# EAGLE design PCB_Official (EAGLE 9.3.0)

## Sheet 1 of 3
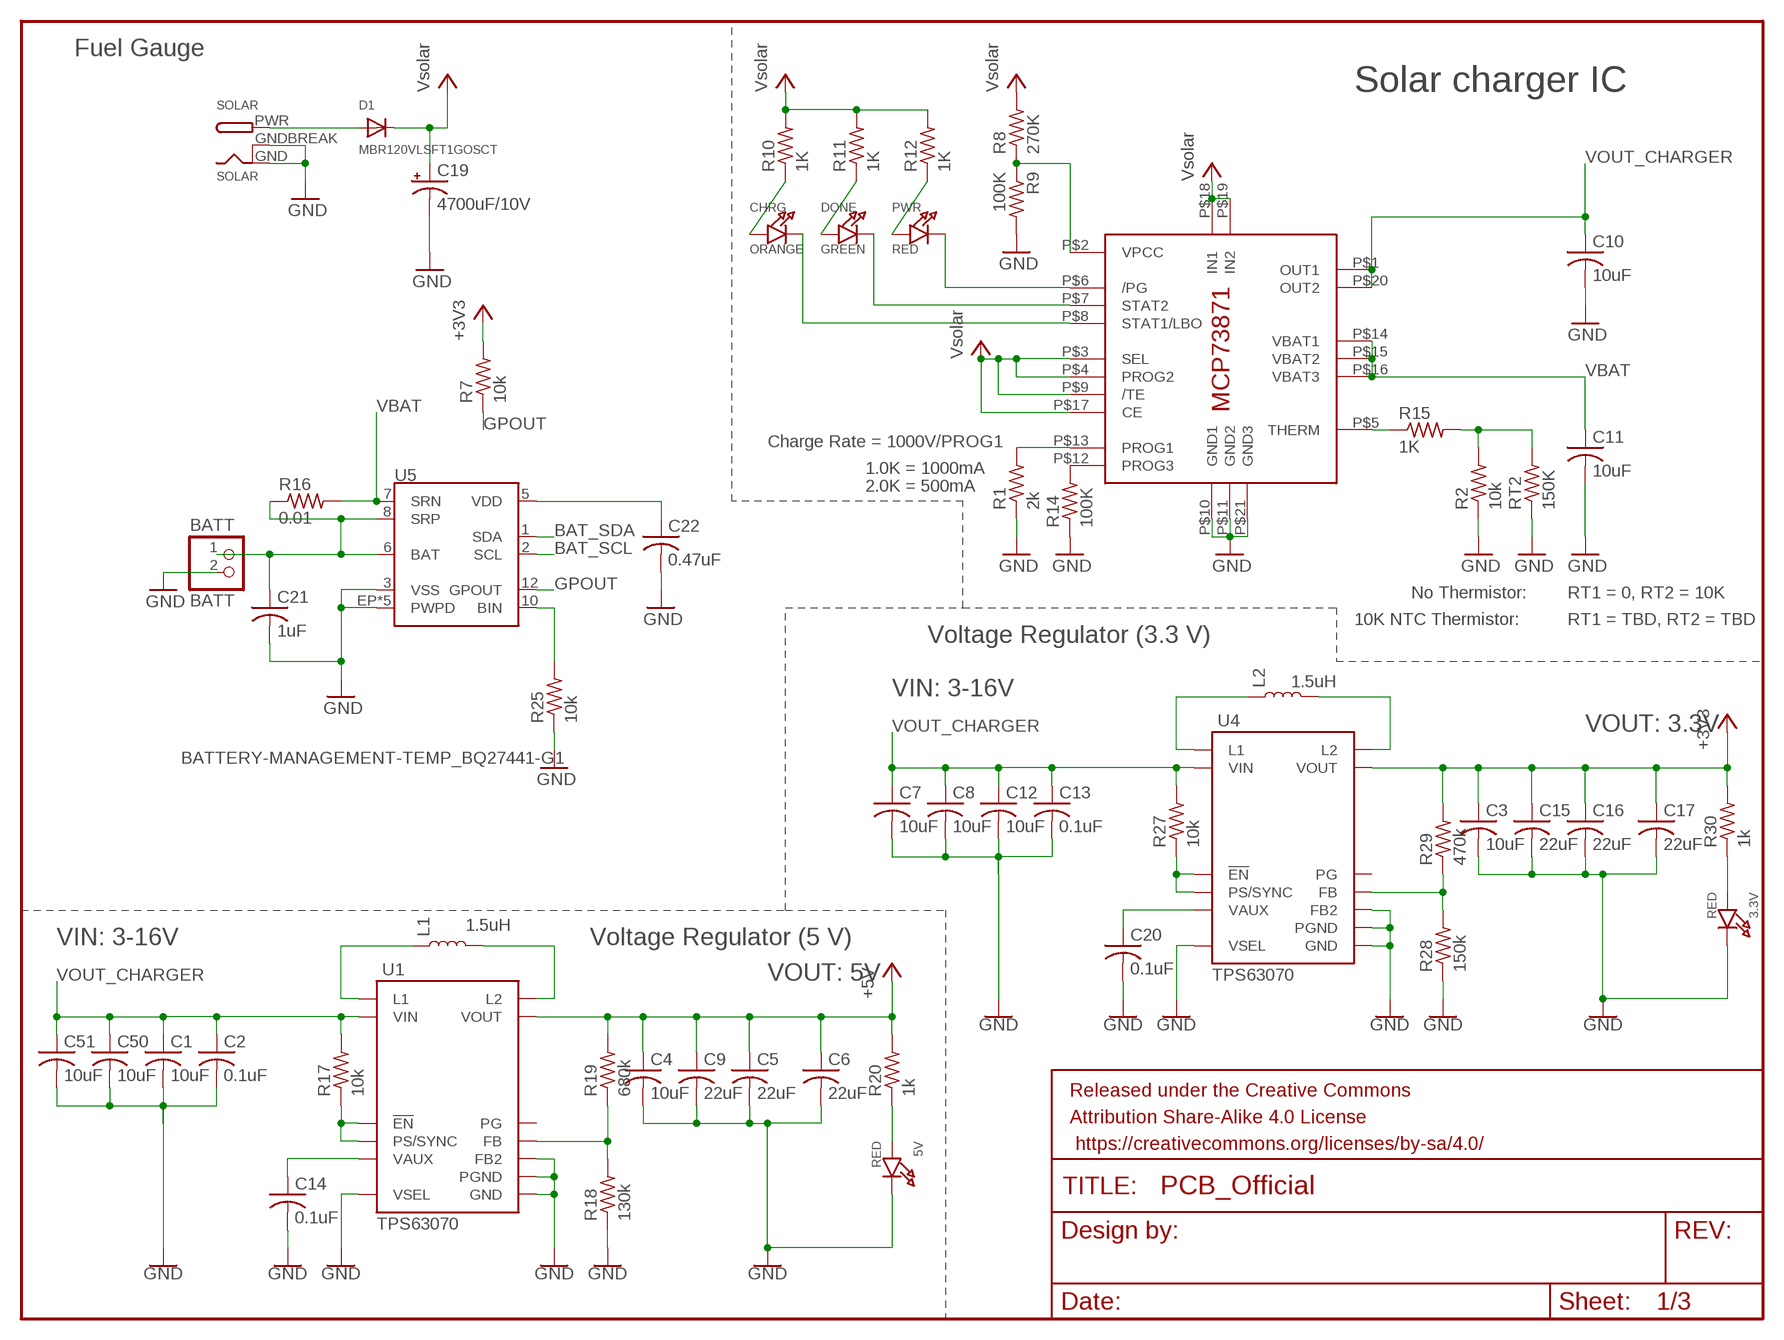
[diagram p0: schematic, sheet 1]

### Parts
3.3V  RED  LED0805_NOOUTLINE  [CHIPLED_0805_NOOUTLINE]
5V  RED  LED0805_NOOUTLINE  [CHIPLED_0805_NOOUTLINE]
BATT  BATT  JST_2PIN-SMT-RA  [JST-PH-2-SMT-RA]
C1  10uF  C-USC0805  [C0805]
C2  0.1uF  C-USC0805  [C0805]
C3  10uF  C-USC0603  [C0603]
C4  10uF  C-USC0603  [C0603]
C5  22uF  C-USC0805  [C0805]
C6  22uF  C-USC0805  [C0805]
C7  10uF  C-USC0603  [C0603]
C8  10uF  C-USC0805  [C0805]
C9  22uF  C-USC0805  [C0805]
C10  10uF  C-USC0805K  [C0805K]
C11  10uF  C-USC0805K  [C0805K]
C12  10uF  C-USC0805  [C0805]
C13  0.1uF  C-USC0805  [C0805]
C14  0.1uF  C-USC0603  [C0603]
C15  22uF  C-USC0805  [C0805]
C16  22uF  C-USC0805  [C0805]
C17  22uF  C-USC0805  [C0805]
C19  4700uF/10V  ADAFRUIT_CPOL-USE5-13  [ADAFRUIT_E5-13]
C20  0.1uF  C-USC0603  [C0603]
C21  1uF  C-USC0805  [C0805]
C22  0.47uF  C-USC0805  [C0805]
C50  10uF  C-USC0805  [C0805]
C51  10uF  C-USC0603  [C0603]
CHRG  ORANGE  LED0805_NOOUTLINE  [CHIPLED_0805_NOOUTLINE]
D1  MBR120VLSFT1GOSCT  MICROBUILDER_DIODESOD-123  [MICROBUILDER_SOD-123]
DONE  GREEN  LED0805_NOOUTLINE  [CHIPLED_0805_NOOUTLINE]
FRAME2  FRAME-LETTERNO_PACKAGE  [DUMMY]
IC1  MCP73871  [QFN20_4MM]
L1  1.5uH  INDUCTOR-XFL40201.5UH  [XFL4020]
L2  1.5uH  INDUCTOR-XFL40201.5UH  [XFL4020]
PWR  RED  LED0805_NOOUTLINE  [CHIPLED_0805_NOOUTLINE]
R1  2k  R-US_R0805  [R0805]
R2  10k  R-US_R0805  [R0805]
R7  10k  R-US_R0805  [R0805]
R8  270K  R-US_R0805  [R0805]
R9  100K  R-US_R0805  [R0805]
R10  1K  R-US_R0805  [R0805]
R11  1K  R-US_R0805  [R0805]
R12  1K  R-US_R0805  [R0805]
R14  100K  R-US_R0805  [R0805]
R15  1K  R-US_M0805  [M0805]
R16  0.01  R-US_R0805  [R0805]
R17  10k  R-US_R0603  [R0603]
R18  130k  R-US_R0603  [R0603]
R19  680k  R-US_R0603  [R0603]
R20  1k  R-US_R0603  [R0603]
R25  10k  R-US_R0805  [R0805]
R27  10k  R-US_R0603  [R0603]
R28  150k  R-US_R0603  [R0603]
R29  470k  R-US_R0603  [R0603]
R30  1k  R-US_R0603  [R0603]
RT2  150K  R-US_M0805  [M0805]
SOLAR  SOLAR  DCBARRELPTH  [DCJACK_2MM_PTH]
U1  TPS63070  [VQFN-15-HR(3X2.5)]
U4  TPS63070  [VQFN-15-HR(3X2.5)]
U5  BATTERY-MANAGEMENT-TEMP_BQ27441-G1  [BATTERY-MANAGEMENT-TEMP_PDSO-N12]

### Nets
!EN: R17.1 U1.P$1(PS/SYNC) U1.P$14(!EN)
!EN1: R27.1 U4.P$1(PS/SYNC) U4.P$14(!EN)
+3V3: C3.1 C15.1 C16.1 C17.1 R7.2 R29.2 R30.2 U4.P$7/8(VOUT) ; also sheet 2,3
+5V: C4.1 C5.1 C6.1 C9.1 R19.2 R20.2 U1.P$7/8(VOUT) ; also sheet 2,3
BAT_SCL: U5.2(SCL) ; also sheet 3
BAT_SDA: U5.1(SDA) ; also sheet 3
GND: 3.3V.C 5V.C BATT.2 C1.2 C2.2 C3.2 C4.2 C5.2 C6.2 C7.2 C8.2 C9.2 C10.2 C11.2 C12.2 C13.2 C14.2 C15.2 C16.2 C17.2 C19.- C20.2 C21.2 C22.2 C50.2 C51.2 IC1.P$10(GND1) IC1.P$11(GND2) IC1.P$21(GND3) R1.1 R2.1 R9.2 R14.1 R18.1 R25.1 R28.1 RT2.1 SOLAR.GND SOLAR.GNDBREAK U1.P$4(GND) U1.P$6(FB2) U1.P$10(PGND) U1.P$15(VSEL) U4.P$4(GND) U4.P$6(FB2) U4.P$10(PGND) U4.P$15(VSEL) U5.3(VSS) U5.EP1(PWPD) U5.EP2(PWPD) U5.EP3(PWPD) U5.EP4(PWPD) U5.EP(PWPD) ; also sheet 2,3
GPOUT: R7.1 U5.12(GPOUT)
N$1: L1.P$1 U1.P$11(L1)
N$2: L1.P$2 U1.P$9(L2)
N$3: IC1.P$2(VPCC) R8.1 R9.1
N$4: R18.2 R19.1 U1.P$5(FB)
N$5: 5V.A R20.1
N$6: C14.1 U1.P$3(VAUX)
N$7: L2.P$1 U4.P$11(L1)
N$8: L2.P$2 U4.P$9(L2)
N$9: C20.1 U4.P$3(VAUX)
N$10: IC1.P$6(/PG) PWR.C
N$11: DONE.C IC1.P$7(STAT2)
N$12: CHRG.C IC1.P$8(STAT1/LBO)
N$13: CHRG.A R10.1
N$14: DONE.A R11.1
N$15: PWR.A R12.1
N$16: IC1.P$12(PROG3) R14.2
N$17: IC1.P$13(PROG1) R1.2
N$18: IC1.P$5(THERM) R15.1
N$19: R2.2 R15.2 RT2.2
N$20: 3.3V.A R30.1
N$21: R28.2 R29.1 U4.P$5(FB)
N$22: BATT.1 C21.1 R16.1 U5.6(BAT) U5.8(SRP)
N$25: C22.1 U5.5(VDD)
N$26: R25.2 U5.10(BIN)
N$32: D1.A SOLAR.PWR
VBAT: C11.1 IC1.P$14(VBAT1) IC1.P$15(VBAT2) IC1.P$16(VBAT3) R16.2 U5.7(SRN)
VCC: C19.+ D1.C IC1.P$3(SEL) IC1.P$4(PROG2) IC1.P$9(/TE) IC1.P$17(CE) IC1.P$18(IN1) IC1.P$19(IN2) R8.2 R10.2 R11.2 R12.2 ; supply symbol labelled Vsolar
VOUT_CHARGER: C1.1 C2.1 C7.1 C8.1 C10.1 C12.1 C13.1 C50.1 C51.1 IC1.P$1(OUT1) IC1.P$20(OUT2) R17.2 R27.2 U1.P$12/13(VIN) U4.P$12/13(VIN)
Unconnected: U1.P$2(PG) U4.P$2(PG)

### Notes on the sheet
- Fuel Gauge
- Solar charger IC
- Charge Rate = 1000V/PROG1
- 1.0K = 1000mA
- 2.0K = 500mA
- No Thermistor: | RT1 = 0, RT2 = 10K
- 10K NTC Thermistor: | RT1 = TBD, RT2 = TBD
- Voltage Regulator (3.3 V)
- VIN: 3-16V
- VOUT: 3.3V
- VIN: 3-16V | Voltage Regulator (5 V)
- VOUT: 5V

## Sheet 2 of 3
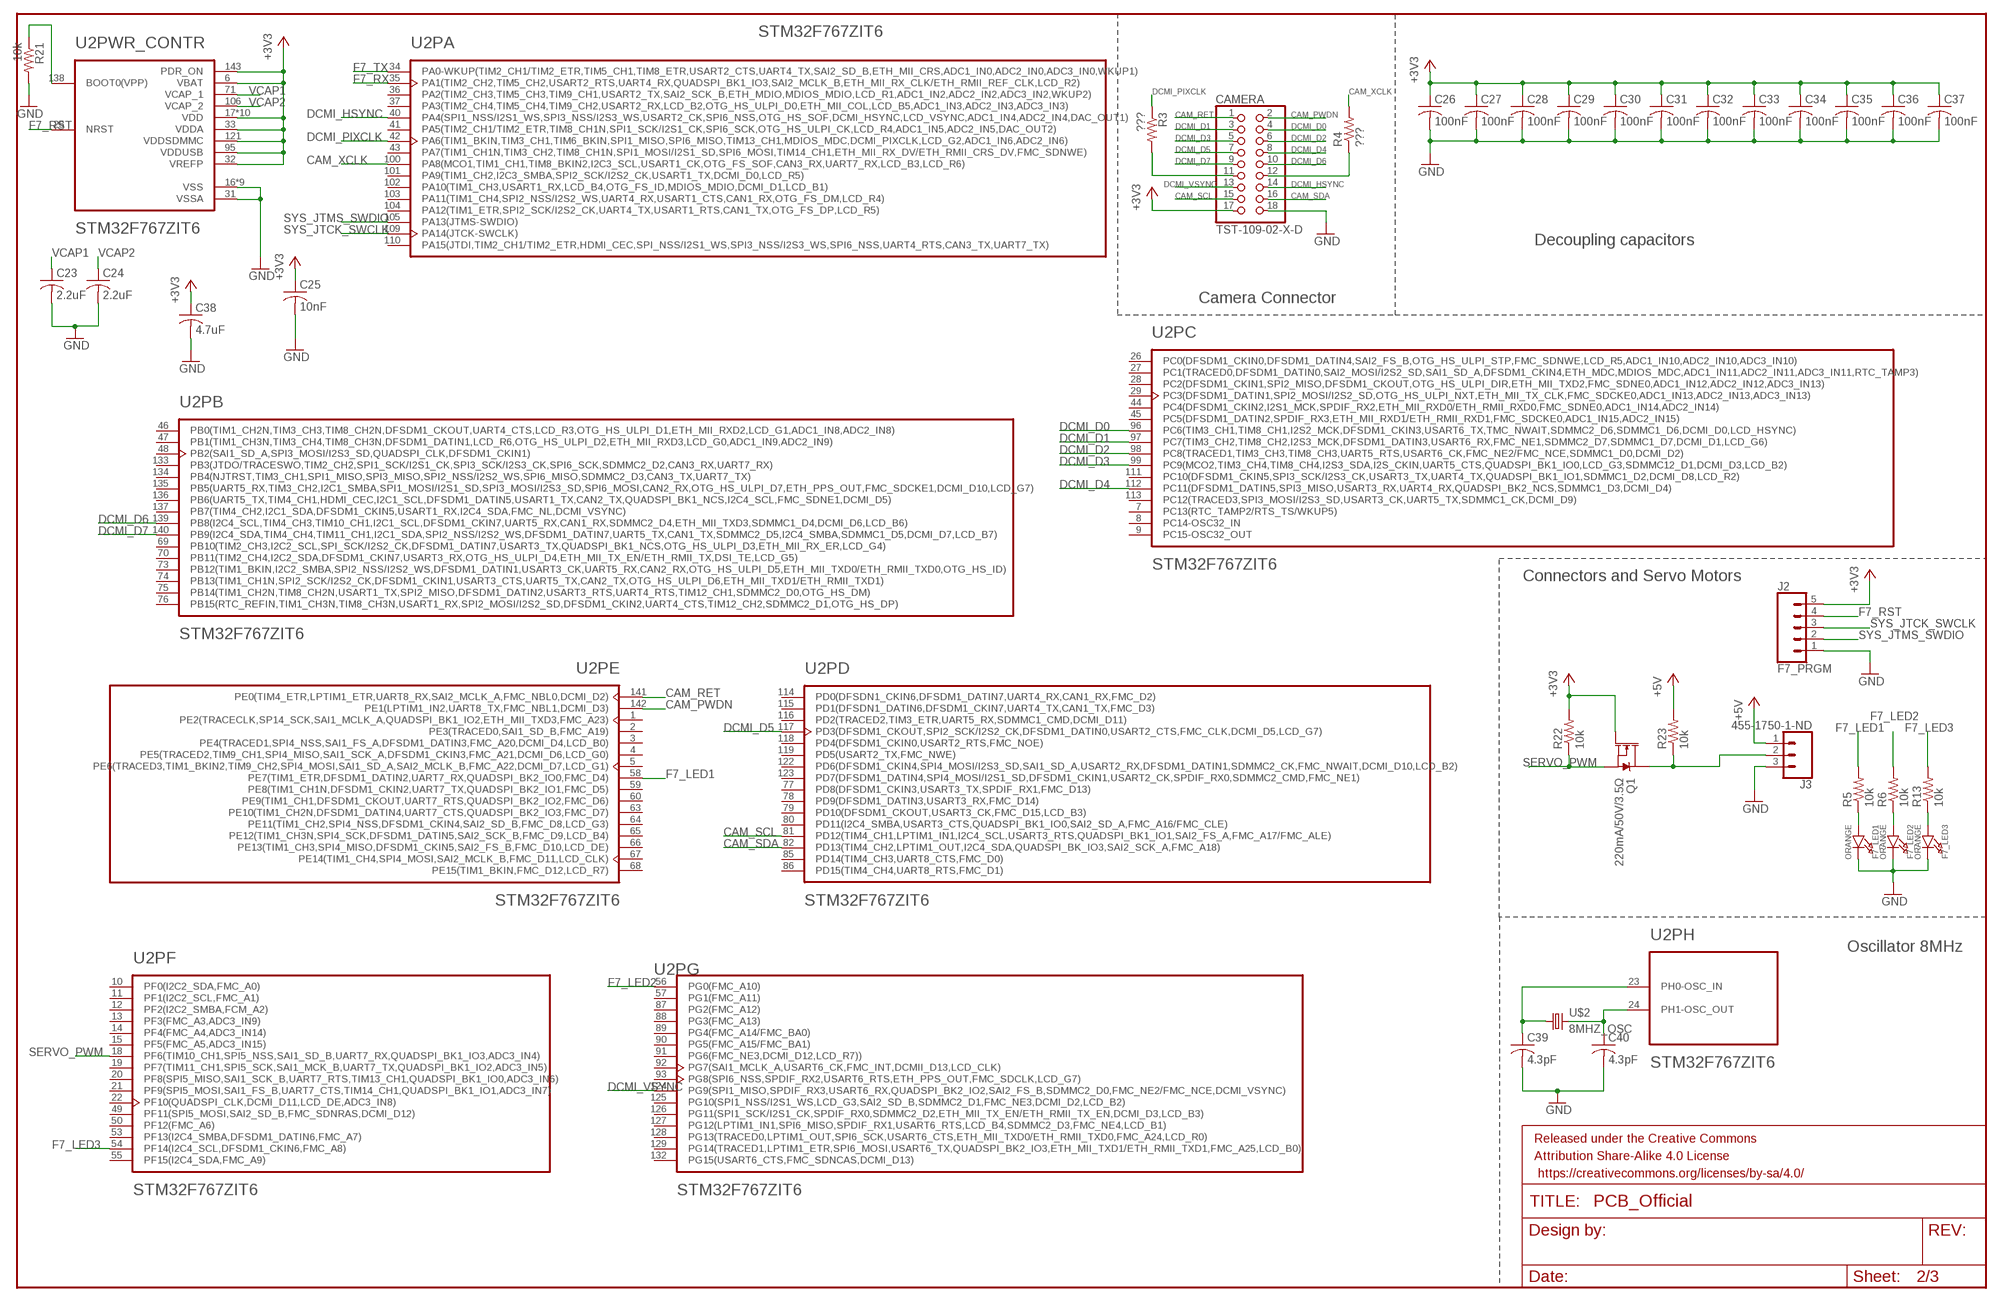
[diagram p1: schematic, sheet 2]

### Parts
C23  2.2uF  C-USC0805  [C0805]
C24  2.2uF  C-USC0805  [C0805]
C25  10nF  C-USC0805  [C0805]
C26  100nF  C-USC0805  [C0805]
C27  100nF  C-USC0805  [C0805]
C28  100nF  C-USC0805  [C0805]
C29  100nF  C-USC0805  [C0805]
C30  100nF  C-USC0805  [C0805]
C31  100nF  C-USC0805  [C0805]
C32  100nF  C-USC0805  [C0805]
C33  100nF  C-USC0805  [C0805]
C34  100nF  C-USC0805  [C0805]
C35  100nF  C-USC0805  [C0805]
C36  100nF  C-USC0805  [C0805]
C37  100nF  C-USC0805  [C0805]
C38  4.7uF  C-USC0805  [C0805]
C39  4.3pF  C-USC0805  [C0805]
C40  4.3pF  C-USC0805  [C0805]
CAMERA  TST-109-02-X-D  [TST-109-02-X-D]
F7_LED1  ORANGE  LED0805_NOOUTLINE  [CHIPLED_0805_NOOUTLINE]
F7_LED2  ORANGE  LED0805_NOOUTLINE  [CHIPLED_0805_NOOUTLINE]
F7_LED3  ORANGE  LED0805_NOOUTLINE  [CHIPLED_0805_NOOUTLINE]
FRAME3  FRAME-LEDGER  [CREATIVE_COMMONS]
J2  F7_PRGM  CONN_05  [1X05]
J3  455-1750-1-ND  CONN_03  [1X03]
Q1  220mA/50V/3.5Ω  MOSFET-NCH-BSS138  [SOT23-3]
R3  ???  R-US_R0805  [R0805]
R4  ???  R-US_R0805  [R0805]
R5  10k  R-US_R0805  [R0805]
R6  10k  R-US_R0805  [R0805]
R13  10k  R-US_R0805  [R0805]
R21  10k  R-US_R0805  [R0805]
R22  10k  R-US_R0805  [R0805]
R23  10k  R-US_R0805  [R0805]
U2  STM32F767ZIT6  [QFP50P2200X2200X160-144N]
U$2  8MHZ_OSC  [8MHZ_OSC]

### Nets
+3V3: C25.1 C26.1 C27.1 C28.1 C29.1 C30.1 C31.1 C32.1 C33.1 C34.1 C35.1 C36.1 C37.1 C38.1 CAMERA.17 J2.5 Q1.1(G) R22.2 U2.6(PWR_CONTR:VBAT) U2.17(PWR_CONTR:VDD) U2.30(PWR_CONTR:VDD) U2.32(PWR_CONTR:VREFP) U2.33(PWR_CONTR:VDDA) U2.39(PWR_CONTR:VDD) U2.52(PWR_CONTR:VDD) U2.62(PWR_CONTR:VDD) U2.72(PWR_CONTR:VDD) U2.84(PWR_CONTR:VDD) U2.95(PWR_CONTR:VDDUSB) U2.108(PWR_CONTR:VDD) U2.121(PWR_CONTR:VDDSDMMC) U2.131(PWR_CONTR:VDD) U2.143(PWR_CONTR:PDR_ON) U2.144(PWR_CONTR:VDD) ; also sheet 1,3
+5V: J3.1 R23.2 ; also sheet 1,3
CAM_PWDN: CAMERA.2 U2.142(PE:PE1(LPTIM1_IN2,UART8_TX,FMC_NBL1,DCMI_D3))
CAM_RET: CAMERA.1 U2.141(PE:PE0(TIM4_ETR,LPTIM1_ETR,UART8_RX,SAI2_MCLK_A,FMC_NBL0,DCMI_D2))
CAM_SCL: CAMERA.15 U2.81(PD:PD12(TIM4_CH1,LPTIM1_IN1,I2C4_SCL,USART3_RTS,QUADSPI_BK1_IO1,SAI2_FS_A,FMC_A17/FMC_ALE))
CAM_SDA: CAMERA.16 U2.82(PD:PD13(TIM4_CH2,LPTIM1_OUT,I2C4_SDA,QUADSPI_BK_IO3,SAI2_SCK_A,FMC_A18))
CAM_XCLK: R4.2 U2.100(PA:PA8(MCO1,TIM1_CH1,TIM8_BKIN2,I2C3_SCL,USART1_CK,OTG_FS_SOF,CAN3_RX,UART7_RX,LCD_B3,LCD_R6))
DCMI_D0: CAMERA.4 U2.96(PC:PC6(TIM3_CH1,TIM8_CH1,I2S2_MCK,DFSDM1_CKIN3,USART6_TX,TMC_NWAIT,SDMMC2_D6,SDMMC1_D6,DCMI_D0,LCD_HSYNC))
DCMI_D1: CAMERA.3 U2.97(PC:PC7(TIM3_CH2,TIM8_CH2,I2S3_MCK,DFSDM1_DATIN3,USART6_RX,FMC_NE1,SDMMC2_D7,SDMMC1_D7,DCMI_D1,LCD_G6))
DCMI_D2: CAMERA.6 U2.98(PC:PC8(TRACED1,TIM3_CH3,TIM8_CH3,UART5_RTS,USART6_CK,FMC_NE2/FMC_NCE,SDMMC1_D0,DCMI_D2))
DCMI_D3: CAMERA.5 U2.99(PC:PC9(MCO2,TIM3_CH4,TIM8_CH4,I2S3_SDA,I2S_CKIN,UART5_CTS,QUADSPI_BK1_IO0,LCD_G3,SDMMC12_D1,DCMI_D3,LCD_B2))
DCMI_D4: CAMERA.8 U2.112(PC:PC11(DFSDM1_DATIN5,SPI3_MISO,USART3_RX,UART4_RX,QUADSPI_BK2_NCS,SDMMC1_D3,DCMI_D4))
DCMI_D5: CAMERA.7 U2.117(PD:PD3(DFSDM1_CKOUT,SPI2_SCK/I2S2_CK,DFSDM1_DATIN0,USART2_CTS,FMC_CLK,DCMI_D5,LCD_G7))
DCMI_D6: CAMERA.10 U2.139(PB:PB8(I2C4_SCL,TIM4_CH3,TIM10_CH1,I2C1_SCL,DFSDM1_CKIN7,UART5_RX,CAN1_RX,SDMMC2_D4,ETH_MII_TXD3,SDMMC1_D4,DCMI_D6,LCD_B6))
DCMI_D7: CAMERA.9 U2.140(PB:PB9(I2C4_SDA,TIM4_CH4,TIM11_CH1,I2C1_SDA,SPI2_NSS/I2S2_WS,DFSDM1_DATIN7,UART5_TX,CAN1_TX,SDMMC2_D5,I2C4_SMBA,SDMMC1_D5,DCMI_D7,LCD_B7))
DCMI_HSYNC: CAMERA.14 U2.40(PA:PA4(SPI1_NSS/I2S1_WS,SPI3_NSS/I2S3_WS,USART2_CK,SPI6_NSS,OTG_HS_SOF,DCMI_HSYNC,LCD_VSYNC,ADC1_IN4,ADC2_IN4,DAC_OUT1))
DCMI_PIXCLK: R3.1 U2.42(PA:PA6(TIM1_BKIN,TIM3_CH1,TIM6_BKIN,SPI1_MISO,SPI6_MISO,TIM13_CH1,MDIOS_MDC,DCMI_PIXCLK,LCD_G2,ADC1_IN6,ADC2_IN6))
DCMI_VSYNC: CAMERA.13 U2.124(PG:PG9(SPI1_MISO,SPDIF_RX3,USART6_RX,QUADSPI_BK2_IO2,SAI2_FS_B,SDMMC2_D0,FMC_NE2/FMC_NCE,DCMI_VSYNC))
F7_LED1: R5.2 U2.58(PE:PE7(TIM1_ETR,DFSDM1_DATIN2,UART7_RX,QUADSPI_BK2_IO0,FMC_D4))
F7_LED2: R6.2 U2.56(PG:PG0(FMC_A10))
F7_LED3: R13.2 U2.54(PF:PF14(I2C4_SCL,DFSDM1_CKIN6,FMC_A8))
F7_RST: J2.4 U2.25(PWR_CONTR:NRST)
F7_RX: U2.35(PA:PA1(TIM2_CH2,TIM5_CH2,USART2_RTS,UART4_RX,QUADSPI_BK1_IO3,SAI2_MCLK_B,ETH_MII_RX_CLK/ETH_RMII_REF_CLK,LCD_R2)) ; also sheet 3
F7_TX: U2.34(PA:PA0-WKUP(TIM2_CH1/TIM2_ETR,TIM5_CH1,TIM8_ETR,USART2_CTS,UART4_TX,SAI2_SD_B,ETH_MII_CRS,ADC1_IN0,ADC2_IN0,ADC3_IN0,WKUP1)) ; also sheet 3
GND: C23.2 C24.2 C25.2 C26.2 C27.2 C28.2 C29.2 C30.2 C31.2 C32.2 C33.2 C34.2 C35.2 C36.2 C37.2 C38.2 C39.2 C40.2 CAMERA.18 F7_LED1.C F7_LED2.C F7_LED3.C J2.1 J3.3 R21.2 U2.16(PWR_CONTR:VSS) U2.31(PWR_CONTR:VSSA) U2.38(PWR_CONTR:VSS) U2.51(PWR_CONTR:VSS) U2.61(PWR_CONTR:VSS) U2.83(PWR_CONTR:VSS) U2.94(PWR_CONTR:VSS) U2.107(PWR_CONTR:VSS) U2.120(PWR_CONTR:VSS) U2.130(PWR_CONTR:VSS) ; also sheet 1,3
N$23: R21.1 U2.138(PWR_CONTR:BOOT0(VPP))
N$27: C40.1 U2.24(PH:PH1-OSC_OUT) U$2.P$2
N$28: C39.1 U2.23(PH:PH0-OSC_IN) U$2.P$1
N$29: J3.2 Q1.3(D) R23.1
N$33: CAMERA.11 R3.2
N$34: CAMERA.12 R4.1
N$35: F7_LED2.A R6.1
N$36: F7_LED3.A R13.1
N$37: F7_LED1.A R5.1
SERVO_PWM: Q1.2(S) R22.1 U2.18(PF:PF6(TIM10_CH1,SPI5_NSS,SAI1_SD_B,UART7_RX,QUADSPI_BK1_IO3,ADC3_IN4))
SYS_JTCK_SWCLK: J2.3 U2.109(PA:PA14(JTCK-SWCLK))
SYS_JTMS_SWDIO: J2.2 U2.105(PA:PA13(JTMS-SWDIO))
VCAP1: C23.1 U2.71(PWR_CONTR:VCAP_1)
VCAP2: C24.1 U2.106(PWR_CONTR:VCAP_2)
Unconnected: U2.1(PE:PE2(TRACECLK,SP14_SCK,SAI1_MCLK_A,QUADSPI_BK1_IO2,ETH_MII_TXD3,FMC_A23)) U2.2(PE:PE3(TRACED0,SAI1_SD_B,FMC_A19)) U2.3(PE:PE4(TRACED1,SPI4_NSS,SAI1_FS_A,DFSDM1_DATIN3,FMC_A20,DCMI_D4,LCD_B0)) U2.4(PE:PE5(TRACED2,TIM9_CH1,SPI4_MISO,SAI1_SCK_A,DFSDM1_CKIN3,FMC_A21,DCMI_D6,LCD_G0)) U2.5(PE:PE6(TRACED3,TIM1_BKIN2,TIM9_CH2,SPI4_MOSI,SAI1_SD_A,SAI2_MCLK_B,FMC_A22,DCMI_D7,LCD_G1)) U2.7(PC:PC13(RTC_TAMP2/RTS_TS/WKUP5)) U2.8(PC:PC14-OSC32_IN) U2.9(PC:PC15-OSC32_OUT) U2.10(PF:PF0(I2C2_SDA,FMC_A0)) U2.11(PF:PF1(I2C2_SCL,FMC_A1)) U2.12(PF:PF2(I2C2_SMBA,FCM_A2)) U2.13(PF:PF3(FMC_A3,ADC3_IN9)) U2.14(PF:PF4(FMC_A4,ADC3_IN14)) U2.15(PF:PF5(FMC_A5,ADC3_IN15)) U2.19(PF:PF7(TIM11_CH1,SPI5_SCK,SAI1_MCK_B,UART7_TX,QUADSPI_BK1_IO2,ADC3_IN5)) U2.20(PF:PF8(SPI5_MISO,SAI1_SCK_B,UART7_RTS,TIM13_CH1,QUADSPI_BK1_IO0,ADC3_IN6)) U2.21(PF:PF9(SPI5_MOSI,SAI1_FS_B,UART7_CTS,TIM14_CH1,QUADSPI_BK1_IO1,ADC3_IN7)) U2.22(PF:PF10(QUADSPI_CLK,DCMI_D11,LCD_DE,ADC3_IN8)) U2.26(PC:PC0(DFSDM1_CKIN0,DFSDM1_DATIN4,SAI2_FS_B,OTG_HS_ULPI_STP,FMC_SDNWE,LCD_R5,ADC1_IN10,ADC2_IN10,ADC3_IN10)) U2.27(PC:PC1(TRACED0,DFSDM1_DATIN0,SAI2_MOSI/I2S2_SD,SAI1_SD_A,DFSDM1_CKIN4,ETH_MDC,MDIOS_MDC,ADC1_IN11,ADC2_IN11,ADC3_IN11,RTC_TAMP3)) U2.28(PC:PC2(DFSDM1_CKIN1,SPI2_MISO,DFSDM1_CKOUT,OTG_HS_ULPI_DIR,ETH_MII_TXD2,FMC_SDNE0,ADC1_IN12,ADC2_IN12,ADC3_IN13)) U2.29(PC:PC3(DFSDM1_DATIN1,SPI2_MOSI/I2S2_SD,OTG_HS_ULPI_NXT,ETH_MII_TX_CLK,FMC_SDCKE0,ADC1_IN13,ADC2_IN13,ADC3_IN13)) U2.36(PA:PA2(TIM2_CH3,TIM5_CH3,TIM9_CH1,USART2_TX,SAI2_SCK_B,ETH_MDIO,MDIOS_MDIO,LCD_R1,ADC1_IN2,ADC2_IN2,ADC3_IN2,WKUP2)) U2.37(PA:PA3(TIM2_CH4,TIM5_CH4,TIM9_CH2,USART2_RX,LCD_B2,OTG_HS_ULPI_D0,ETH_MII_COL,LCD_B5,ADC1_IN3,ADC2_IN3,ADC3_IN3)) U2.41(PA:PA5(TIM2_CH1/TIM2_ETR,TIM8_CH1N,SPI1_SCK/I2S1_CK,SPI6_SCK,OTG_HS_ULPI_CK,LCD_R4,ADC1_IN5,ADC2_IN5,DAC_OUT2)) U2.43(PA:PA7(TIM1_CH1N,TIM3_CH2,TIM8_CH1N,SPI1_MOSI/I2S1_SD,SPI6_MOSI,TIM14_CH1,ETH_MII_RX_DV/ETH_RMII_CRS_DV,FMC_SDNWE)) U2.44(PC:PC4(DFSDM1_CKIN2,I2S1_MCK,SPDIF_RX2,ETH_MII_RXD0/ETH_RMII_RXD0,FMC_SDNE0,ADC1_IN14,ADC2_IN14)) U2.45(PC:PC5(DFSDM1_DATIN2,SPDIF_RX3,ETH_MII_RXD1/ETH_RMII_RXD1,FMC_SDCKE0,ADC1_IN15,ADC2_IN15)) U2.46(PB:PB0(TIM1_CH2N,TIM3_CH3,TIM8_CH2N,DFSDM1_CKOUT,UART4_CTS,LCD_R3,OTG_HS_ULPI_D1,ETH_MII_RXD2,LCD_G1,ADC1_IN8,ADC2_IN8)) U2.47(PB:PB1(TIM1_CH3N,TIM3_CH4,TIM8_CH3N,DFSDM1_DATIN1,LCD_R6,OTG_HS_ULPI_D2,ETH_MII_RXD3,LCD_G0,ADC1_IN9,ADC2_IN9)) U2.48(PB:PB2(SAI1_SD_A,SPI3_MOSI/I2S3_SD,QUADSPI_CLK,DFSDM1_CKIN1)) U2.49(PF:PF11(SPI5_MOSI,SAI2_SD_B,FMC_SDNRAS,DCMI_D12)) U2.50(PF:PF12(FMC_A6)) U2.53(PF:PF13(I2C4_SMBA,DFSDM1_DATIN6,FMC_A7)) U2.55(PF:PF15(I2C4_SDA,FMC_A9)) U2.57(PG:PG1(FMC_A11)) U2.59(PE:PE8(TIM1_CH1N,DFSDM1_CKIN2,UART7_TX,QUADSPI_BK2_IO1,FMC_D5)) U2.60(PE:PE9(TIM1_CH1,DFSDM1_CKOUT,UART7_RTS,QUADSPI_BK2_IO2,FMC_D6)) U2.63(PE:PE10(TIM1_CH2N,DFSDM1_DATIN4,UART7_CTS,QUADSPI_BK2_IO3,FMC_D7)) U2.64(PE:PE11(TIM1_CH2,SPI4_NSS,DFSDM1_CKIN4,SAI2_SD_B,FMC_D8,LCD_G3)) U2.65(PE:PE12(TIM1_CH3N,SPI4_SCK,DFSDM1_DATIN5,SAI2_SCK_B,FMC_D9,LCD_B4)) U2.66(PE:PE13(TIM1_CH3,SPI4_MISO,DFSDM1_CKIN5,SAI2_FS_B,FMC_D10,LCD_DE)) U2.67(PE:PE14(TIM1_CH4,SPI4_MOSI,SAI2_MCLK_B,FMC_D11,LCD_CLK)) U2.68(PE:PE15(TIM1_BKIN,FMC_D12,LCD_R7)) U2.69(PB:PB10(TIM2_CH3,I2C2_SCL,SPI_SCK/I2S2_CK,DFSDM1_DATIN7,USART3_TX,QUADSPI_BK1_NCS,OTG_HS_ULPI_D3,ETH_MII_RX_ER,LCD_G4)) U2.70(PB:PB11(TIM2_CH4,I2C2_SDA,DFSDM1_CKIN7,USART3_RX,OTG_HS_ULPI_D4,ETH_MII_TX_EN/ETH_RMII_TX,DSI_TE,LCD_G5)) U2.73(PB:PB12(TIM1_BKIN,I2C2_SMBA,SPI2_NSS/I2S2_WS,DFSDM1_DATIN1,USART3_CK,UART5_RX,CAN2_RX,OTG_HS_ULPI_D5,ETH_MII_TXD0/ETH_RMII_TXD0,OTG_HS_ID)) U2.74(PB:PB13(TIM1_CH1N,SPI2_SCK/I2S2_CK,DFSDM1_CKIN1,USART3_CTS,UART5_TX,CAN2_TX,OTG_HS_ULPI_D6,ETH_MII_TXD1/ETH_RMII_TXD1)) U2.75(PB:PB14(TIM1_CH2N,TIM8_CH2N,USART1_TX,SPI2_MISO,DFSDM1_DATIN2,USART3_RTS,UART4_RTS,TIM12_CH1,SDMMC2_D0,OTG_HS_DM)) U2.76(PB:PB15(RTC_REFIN,TIM1_CH3N,TIM8_CH3N,USART1_RX,SPI2_MOSI/I2S2_SD,DFSDM1_CKIN2,UART4_CTS,TIM12_CH2,SDMMC2_D1,OTG_HS_DP)) U2.77(PD:PD8(DFSDM1_CKIN3,USART3_TX,SPDIF_RX1,FMC_D13)) U2.78(PD:PD9(DFSDM1_DATIN3,USART3_RX,FMC_D14)) U2.79(PD:PD10(DFSDM1_CKOUT,USART3_CK,FMC_D15,LCD_B3)) U2.80(PD:PD11(I2C4_SMBA,USART3_CTS,QUADSPI_BK1_IO0,SAI2_SD_A,FMC_A16/FMC_CLE)) U2.85(PD:PD14(TIM4_CH3,UART8_CTS,FMC_D0)) U2.86(PD:PD15(TIM4_CH4,UART8_RTS,FMC_D1)) U2.87(PG:PG2(FMC_A12)) U2.88(PG:PG3(FMC_A13)) U2.89(PG:PG4(FMC_A14/FMC_BA0)) U2.90(PG:PG5(FMC_A15/FMC_BA1)) U2.91(PG:PG6(FMC_NE3,DCMI_D12,LCD_R7))) U2.92(PG:PG7(SAI1_MCLK_A,USART6_CK,FMC_INT,DCMII_D13,LCD_CLK)) U2.93(PG:PG8(SPI6_NSS,SPDIF_RX2,USART6_RTS,ETH_PPS_OUT,FMC_SDCLK,LCD_G7)) U2.101(PA:PA9(TIM1_CH2,I2C3_SMBA,SPI2_SCK/I2S2_CK,USART1_TX,DCMI_D0,LCD_R5)) U2.102(PA:PA10(TIM1_CH3,USART1_RX,LCD_B4,OTG_FS_ID,MDIOS_MDIO,DCMI_D1,LCD_B1)) U2.103(PA:PA11(TIM1_CH4,SPI2_NSS/I2S2_WS,UART4_RX,USART1_CTS,CAN1_RX,OTG_FS_DM,LCD_R4)) U2.104(PA:PA12(TIM1_ETR,SPI2_SCK/I2S2_CK,UART4_TX,USART1_RTS,CAN1_TX,OTG_FS_DP,LCD_R5)) U2.110(PA:PA15(JTDI,TIM2_CH1/TIM2_ETR,HDMI_CEC,SPI_NSS/I2S1_WS,SPI3_NSS/I2S3_WS,SPI6_NSS,UART4_RTS,CAN3_TX,UART7_TX)) U2.111(PC:PC10(DFSDM1_CKIN5,SPI3_SCK/I2S3_CK,USART3_TX,UART4_TX,QUADSPI_BK1_IO1,SDMMC1_D2,DCMI_D8,LCD_R2)) U2.113(PC:PC12(TRACED3,SPI3_MOSI/I2S3_SD,USART3_CK,UART5_TX,SDMMC1_CK,DCMI_D9)) U2.114(PD:PD0(DFSDN1_CKIN6,DFSDM1_DATIN7,UART4_RX,CAN1_RX,FMC_D2)) U2.115(PD:PD1(DFSDN1_DATIN6,DFSDM1_CKIN7,UART4_TX,CAN1_TX,FMC_D3)) U2.116(PD:PD2(TRACED2,TIM3_ETR,UART5_RX,SDMMC1_CMD,DCMI_D11)) U2.118(PD:PD4(DFSDM1_CKIN0,USART2_RTS,FMC_NOE)) U2.119(PD:PD5(USART2_TX,FMC_NWE)) U2.122(PD:PD6(DFSDM1_CKIN4,SPI4_MOSI/I2S3_SD,SAI1_SD_A,USART2_RX,DFSDM1_DATIN1,SDMMC2_CK,FMC_NWAIT,DCMI_D10,LCD_B2)) U2.123(PD:PD7(DFSDM1_DATIN4,SPI4_MOSI/I2S1_SD,DFSDM1_CKIN1,USART2_CK,SPDIF_RX0,SDMMC2_CMD,FMC_NE1)) U2.125(PG:PG10(SPI1_NSS/I2S1_WS,LCD_G3,SAI2_SD_B,SDMMC2_D1,FMC_NE3,DCMI_D2,LCD_B2)) U2.126(PG:PG11(SPI1_SCK/I2S1_CK,SPDIF_RX0,SDMMC2_D2,ETH_MII_TX_EN/ETH_RMII_TX_EN,DCMI_D3,LCD_B3)) U2.127(PG:PG12(LPTIM1_IN1,SPI6_MISO,SPDIF_RX1,USART6_RTS,LCD_B4,SDMMC2_D3,FMC_NE4,LCD_B1)) U2.128(PG:PG13(TRACED0,LPTIM1_OUT,SPI6_SCK,USART6_CTS,ETH_MII_TXD0/ETH_RMII_TXD0,FMC_A24,LCD_R0)) U2.129(PG:PG14(TRACED1,LPTIM1_ETR,SPI6_MOSI,USART6_TX,QUADSPI_BK2_IO3,ETH_MII_TXD1/ETH_RMII_TXD1,FMC_A25,LCD_B0)) U2.132(PG:PG15(USART6_CTS,FMC_SDNCAS,DCMI_D13)) U2.133(PB:PB3(JTDO/TRACESWO,TIM2_CH2,SPI1_SCK/I2S1_CK,SPI3_SCK/I2S3_CK,SPI6_SCK,SDMMC2_D2,CAN3_RX,UART7_RX)) U2.134(PB:PB4(NJTRST,TIM3_CH1,SPI1_MISO,SPI3_MISO,SPI2_NSS/I2S2_WS,SPI6_MISO,SDMMC2_D3,CAN3_TX,UART7_TX)) U2.135(PB:PB5(UART5_RX,TIM3_CH2,I2C1_SMBA,SPI1_MOSI/I2S1_SD,SPI3_MOSI/I2S3_SD,SPI6_MOSI,CAN2_RX,OTG_HS_ULPI_D7,ETH_PPS_OUT,FMC_SDCKE1,DCMI_D10,LCD_G7)) U2.136(PB:PB6(UART5_TX,TIM4_CH1,HDMI_CEC,I2C1_SCL,DFSDM1_DATIN5,USART1_TX,CAN2_TX,QUADSPI_BK1_NCS,I2C4_SCL,FMC_SDNE1,DCMI_D5)) U2.137(PB:PB7(TIM4_CH2,I2C1_SDA,DFSDM1_CKIN5,USART1_RX,I2C4_SDA,FMC_NL,DCMI_VSYNC))

### Notes on the sheet
- Decoupling capacitors
- Camera Connector
- Connectors and Servo Motors
- Oscillator 8MHz

## Sheet 3 of 3
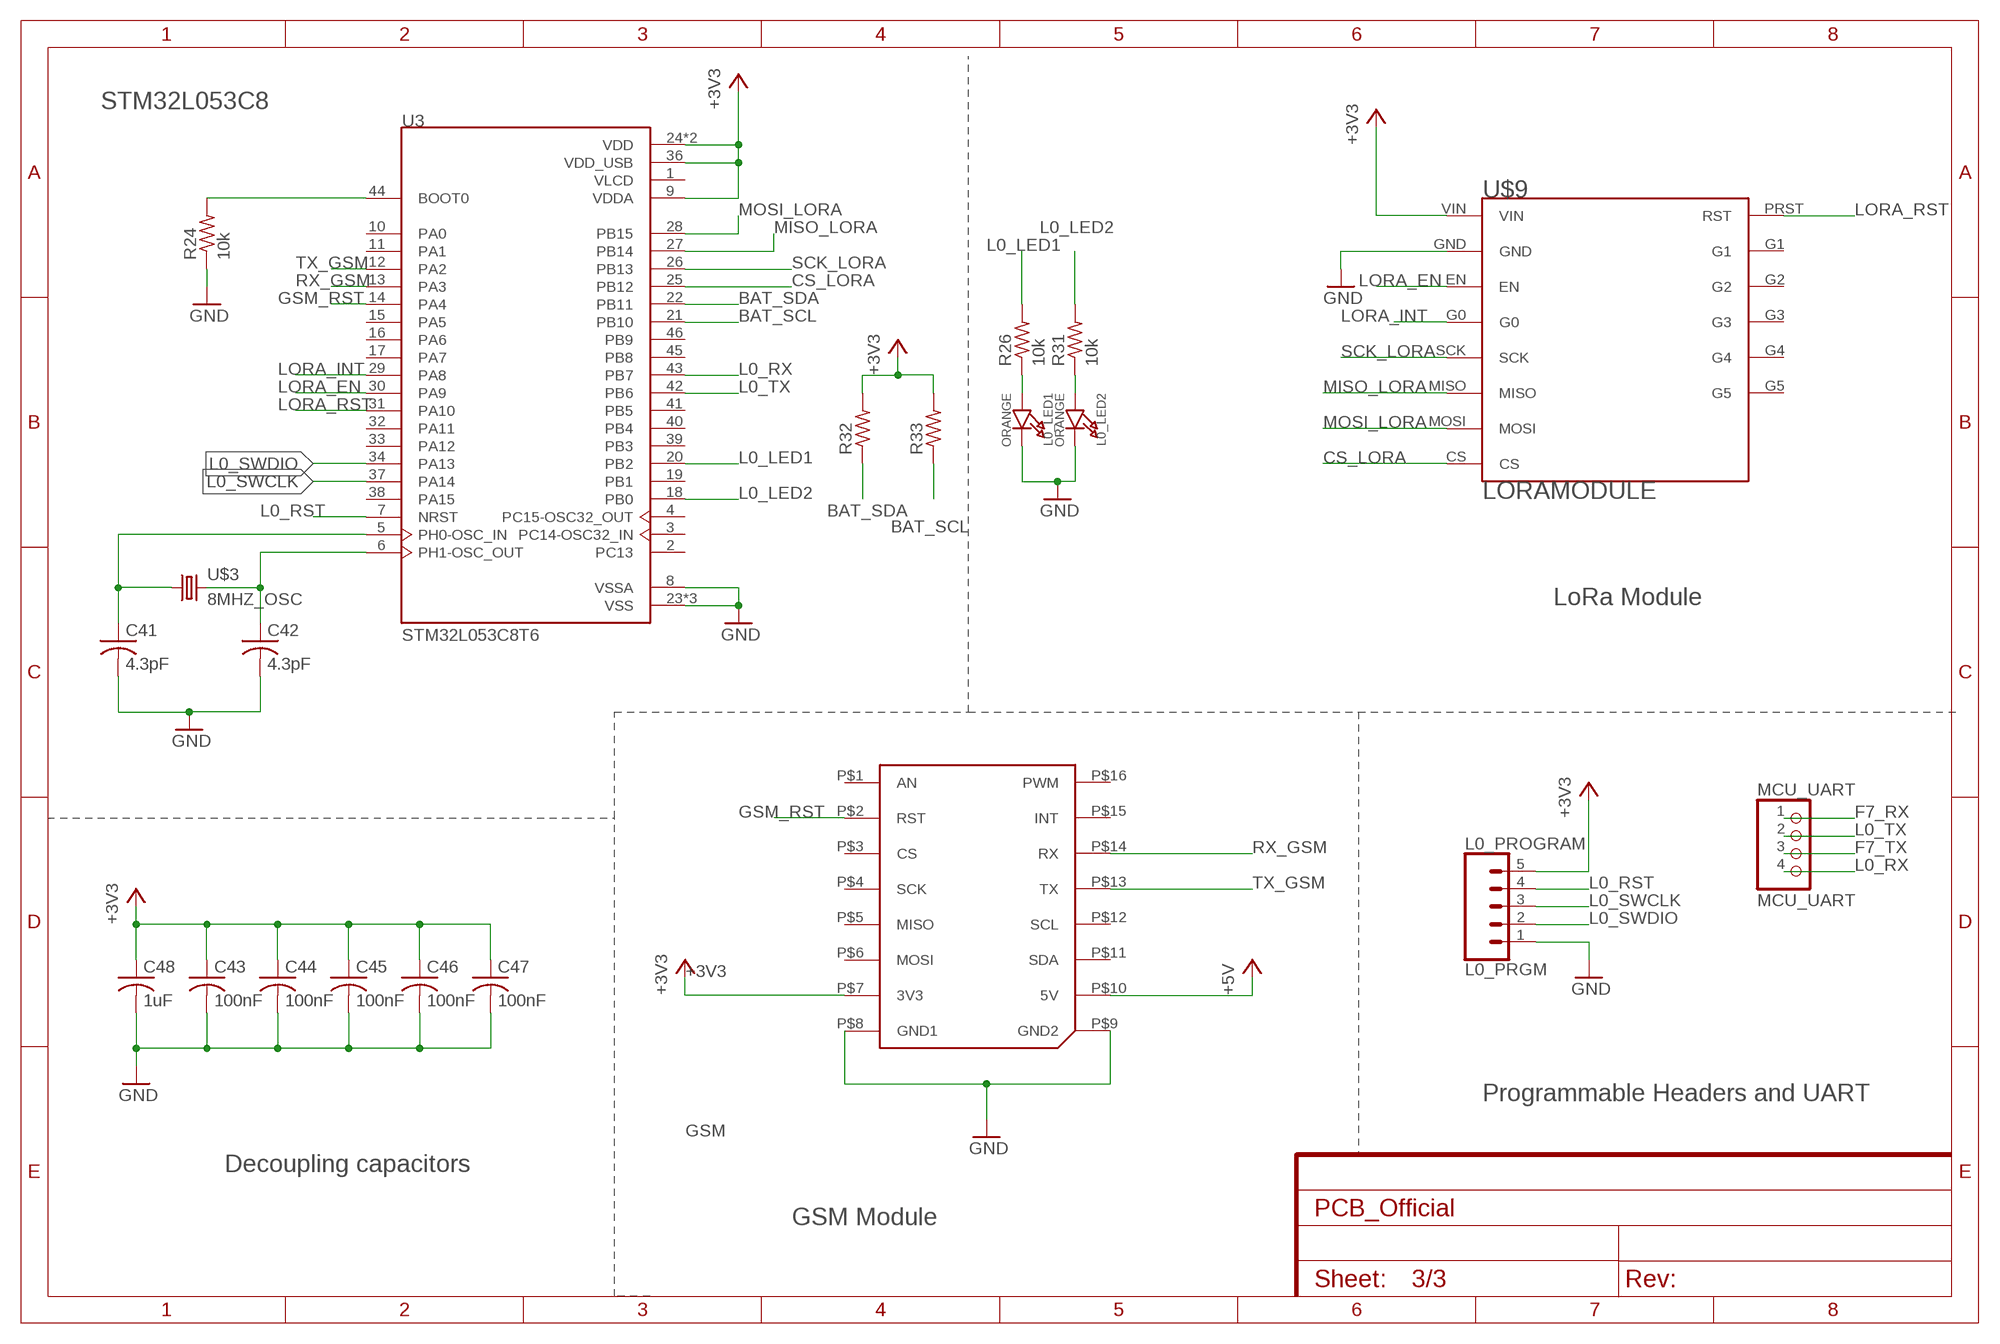
[diagram p2: schematic, sheet 3]

### Parts
C41  4.3pF  C-USC0805  [C0805]
C42  4.3pF  C-USC0805  [C0805]
C43  100nF  C-USC0805  [C0805]
C44  100nF  C-USC0805  [C0805]
C45  100nF  C-USC0805  [C0805]
C46  100nF  C-USC0805  [C0805]
C47  100nF  C-USC0805  [C0805]
C48  1uF  C-USC0805  [C0805]
L0_LED1  ORANGE  LED0805_NOOUTLINE  [CHIPLED_0805_NOOUTLINE]
L0_LED2  ORANGE  LED0805_NOOUTLINE  [CHIPLED_0805_NOOUTLINE]
L0_PROGRAM  L0_PRGM  CONN_05  [1X05]
MCU_UART  MCU_UART  PINHD-1X4  [1X04]
R24  10k  R-US_R0805  [R0805]
R26  10k  R-US_R0805  [R0805]
R31  10k  R-US_R0805  [R0805]
R32  R-US_R0805  [R0805]
R33  R-US_R0805  [R0805]
U3  STM32L053C8T6  [QFP50P900X900X160-48N]
U$1  MIKROE_CLICKLARGE  [MIKROE_BUS_LARGE]
U$3  8MHZ_OSC  [8MHZ_OSC]
U$9  LORAMODULE  [LORAMODULE]

### Nets
+3V3: C43.1 C44.1 C45.1 C46.1 C47.1 C48.1 L0_PROGRAM.5 R32.2 R33.2 U3.9(VDDA) U3.24(VDD) U3.36(VDD_USB) U3.48(VDD) U$1.P$7(3V3) U$9.VIN ; also sheet 1,2
+5V: U$1.P$10(5V) ; also sheet 1,2
BAT_SCL: R33.1 U3.21(PB10) ; also sheet 1
BAT_SDA: R32.1 U3.22(PB11) ; also sheet 1
CS_LORA: U3.25(PB12) U$9.CS
F7_RX: MCU_UART.1 ; also sheet 2
F7_TX: MCU_UART.3 ; also sheet 2
GND: C41.2 C42.2 C43.2 C44.2 C45.2 C46.2 C47.2 C48.2 L0_LED1.C L0_LED2.C L0_PROGRAM.1 R24.1 U3.8(VSSA) U3.23(VSS) U3.35(VSS) U3.47(VSS) U$1.P$8(GND1) U$1.P$9(GND2) U$9.GND ; also sheet 1,2
GSM_RST: U3.14(PA4) U$1.P$2(RST)
L0_LED1: R26.2 U3.20(PB2)
L0_LED2: R31.2 U3.18(PB0)
L0_RST: L0_PROGRAM.4 U3.7(NRST)
L0_RX: MCU_UART.4 U3.43(PB7)
L0_SWCLK: L0_PROGRAM.3 U3.37(PA14)
L0_SWDIO: L0_PROGRAM.2 U3.34(PA13)
L0_TX: MCU_UART.2 U3.42(PB6)
LORA_EN: U3.30(PA9) U$9.EN
LORA_INT: U3.29(PA8) U$9.G0
LORA_RST: U3.31(PA10) U$9.PRST(RST)
MISO_LORA: U3.27(PB14) U$9.MISO
MOSI_LORA: U3.28(PB15) U$9.MOSI
N$24: R24.2 U3.44(BOOT0)
N$30: C42.1 U3.6(PH1-OSC_OUT) U$3.P$2
N$31: C41.1 U3.5(PH0-OSC_IN) U$3.P$1
N$38: L0_LED2.A R31.1
N$40: L0_LED1.A R26.1
RX_GSM: U3.13(PA3) U$1.P$14(RX)
SCK_LORA: U3.26(PB13) U$9.SCK
TX_GSM: U3.12(PA2) U$1.P$13(TX)
Unconnected: U3.1(VLCD) U3.2(PC13) U3.3(PC14-OSC32_IN) U3.4(PC15-OSC32_OUT) U3.10(PA0) U3.11(PA1) U3.15(PA5) U3.16(PA6) U3.17(PA7) U3.19(PB1) U3.32(PA11) U3.33(PA12) U3.38(PA15) U3.39(PB3) U3.40(PB4) U3.41(PB5) U3.45(PB8) U3.46(PB9) U$1.P$1(AN) U$1.P$3(CS) U$1.P$4(SCK) U$1.P$5(MISO) U$1.P$6(MOSI) U$1.P$11(SDA) U$1.P$12(SCL) U$1.P$15(INT) U$1.P$16(PWM) U$9.G1 U$9.G2 U$9.G3 U$9.G4 U$9.G5

### Notes on the sheet
- STM32L053C8
- LoRa Module
- Programmable Headers and UART
- GSM
- Decoupling capacitors
- GSM Module

## Library data of the parts
3.3V 5V CHRG DONE F7_LED1-F7_LED3 L0_LED1 L0_LED2 PWR = microbuilder:LED: LED 0603 - 0603 Surface Mount Package 2mA: Green LED - Low Power (3.9mcd, 2ma, 1.7Vf) - Digikey: 475-2709-2-ND Orange LED - Low Power (9.8mcd, 2ma, 1.8Vf) - Digikey: 475-1194-2-ND Red LED - Low Power (5mcd, 2ma, 1.8Vf) - Digikey: 475-1195-2-ND Yellow LED - Low Power (7mcd, 2ma, 1.8Vf) - Digikey: 475-1196-2-ND 5mA: Blue LED - Low Power (17mcd, 5ma, 2.9Vf) - Digikey: LNJ937W8CRACT-ND 0805 - 0805 Surface Mount Package 2mA: Red LED (8.8mcd, 2mA, 1.8Vf, Clear) - Low Power [Digikey: 475-2510-1-ND] Green LED (5mcd, 2mA, 1.8Vf, Clear) - Low Power [Digikey: 475-2730-1-ND] Yellow LED (11.3mcd, 2mA, 1.8Vf, Clear) - Low Power [Digikey: 475-2555-1-ND] 20mA: Red LED (104mcd, 20mA, Diffused) - LS R976 [Digikey: 475-1278-6-ND] Red LED (12mcd, 20mA, 2.0Vf, Clear) - APT2012EC [Digikey: 754-1128-1-ND] Green LED (15mcd, 20mA, 2.2Vf, Clear) - APT2012GC [Digikey: 754-1131-1-ND] Orange LED (160mcd, 20mA, 2.1Vf, Clear) - APT2012SECK [Digikey: 754-1130-1-ND] 1206 - 1206 Surface Mount Package Green LED (26mcd, 20mA, Diffused) - LG N971 [Digikey: 475-1407-6-ND] Red LED (15mcd, 20mA, Diffused) - LH N974 [Digikey: 475-1416-6-ND] Cree - Cree High-Power Surface Mount LEDs XPEBWT-L1-0000-00D50 - White 111lm 350mA 2.9Vf 6200K 110° XTEAWT-00-0000-00000LEE3 - White 114lm 350mA 2.85Vf 5000K 115° Everlight - Everlight 45-21 Series Surface Mount LEDs 45-21/QK2C-B2832AC2CB2/2T - Warm White 2000mcd 20mA 3.25Vf 3050K 120° 45-21/LK2C-B38452C4CB2/2T - Nuetral White 2000mcd 20mA 3.25Vf 4150K 120° 45-21/LK2C-B50634C6CB2/2T - Cold White 2200mcd 20mA 3.25Vf 5650K 120° PLCC2 Reverse Mount LS T77K-J1L2-1-0-2-R18-Z - Red 11.25mcd 2mA 1.8Vf 630nm 120° LO T77K-L1M2-24-Z - Orange 19.6mcd 2mA 1.8Vf 606nm 120° LY T77K-K2M1-26-Z - Yellow 15.7mcd 2mA 1.8Vf 587nm 120°
BATT = adafruit:JST_2PIN: JST 2-Pin Connectors of various flavors SMT-RA (S2B-PH-SM4) 4UConnector #17311 SMT (B2B-PH-SM4) THM-RA (S2B-PH) THM (B2B-PH)
C1 C2 C5 C6 C8-C13 C15-C17 C50 = adafruit:C-US: CAPACITOR, American symbol
C3 C4 C7 C14 C20-C48 C51 = rcl:C-US: CAPACITOR, American symbol; SPICEPREFIX: C
C19 = ForestVisionParts:ADAFRUIT_CPOL-US: POLARIZED CAPACITOR, American symbol
CAMERA = ForestVisionParts:TST-109-02-X-D
D1 = ForestVisionParts:MICROBUILDER_DIODE: Diode SMA Model Volts Amps Type Vf Vr Digikey # Notes SSA34-E3 40V 3A Schottky 480mV @ 3A 200uA @ 40V SSA34-E3/61TGITR-ND CDBA120-G 20V 1A Schottky 500mV @ 1A 500uA @ 20V 641-1014-6-ND REEL MBRA210 10V 2A Schottky 350mV @ 2A 700uA @ 10V MBRA210LT3 SOD-123 Model Volts Amps Type Vf Vr Order # Notes BAT54T1G 30V 200mA Schottky 800mV @ 200mA 2uA @ 25V BAT54T1GOSTR-ND B0530W 30V 500mA Schottky 430mV @ 500mA 130uA @ 30V B0530W-FDICT-ND REEL MBR120 20V 1A Schottky 340mV @ 1A MBR120VLSFT1GOSCT-ND SOD-323 Model Volts Amps Type Vf Vr Order # Notes PMEG2005EJ 20V 500mA Schottky 355mV @ 500mA 568-4110-1-ND ZLLS410 10V 570mA Schottky 380mV @ 570mA ZLLS410CT-ND 1N4148WS 75V 150mA Silicon/Simple 1V 1N4148WSFSCT-ND REEL SOD-523 Model Volts Amps Type Vf Vr Order # Notes BAT54XV2 30V 200mA Schottky 0.8V @ 100mA BAT54XV2CT-ND TB751S 30V 30mA Schottky RB751S-40TE61CT-ND SOT23-R/W (R = Solder Paste/Reflow Ovens, W = Hand-Soldering) Model Volts Amps Type Vf Vr Order # Notes BAT54FILM 40V 300mA Schottky 497-7162-1-ND
FRAME2 = SparkFun-Aesthetics:FRAME-LETTER: Schematic Frame - Letter Standard 8.5x11 US Letter frame; DESIGNER: Nobody; VERSION: v01
FRAME3 = SparkFun-Aesthetics:FRAME-LEDGER: Schematic Frame - Ledger Standard 11x14 US Ledger frame
IC1 = adafruit:MCP73871
J2 L0_PROGRAM = SparkFun-Connectors:CONN_05: Multi connection point. Often used as Generic Header-pin footprint for 0.1 inch spaced/style header connections On any of the 0.1 inch spaced packages, you can populate with these: Break Away Headers - Straight <https://www.sparkfun.com/products/116> (PRT-00116) Break Away Male Headers - Right Angle <https://www.sparkfun.com/products/553> (PRT-00553) Female Headers <https://www.sparkfun.com/products/115> (PRT-00115) Break Away Headers - Machine Pin <https://www.sparkfun.com/products/117> (PRT-00117) Break Away Female Headers - Swiss Machine Pin <https://www.sparkfun.com/products/743> (PRT-00743) For SCREWTERMINALS and SPRING TERMINALS visit here: Screw Terimnals on SparkFun.com <https://www.sparkfun.com/search/results?term=Screw+Terminals> (5mm/3.5mm/2.54mm spacing) This device is also useful as a general connection point to wire up your design to another part of your project. Our various solder wires solder well into these plated through hole pads. Hook-Up Wire - Assortment (Stranded, 22 AWG) <https://www.sparkfun.com/products/11375> (PRT-11375) Hook-Up Wire - Assortment (Solid Core, 22 AWG) <https://www.sparkfun.com/products/11367> (PRT-11367) View the entire wire category on our website here <https://www.sparkfun.com/categories/141> Special notes: Molex polarized connector foot print use with SKU : PRT-08231 with associated crimp pins and housings. 1MM SMD Version SKU: PRT-10208
J3 = SparkFun-Connectors:CONN_03: Multi connection point. Often used as Generic Header-pin footprint for 0.1 inch spaced/style header connections On any of the 0.1 inch spaced packages, you can populate with these: Break Away Headers - Straight <https://www.sparkfun.com/products/116> (PRT-00116) Break Away Male Headers - Right Angle <https://www.sparkfun.com/products/553> (PRT-00553) Female Headers <https://www.sparkfun.com/products/115> (PRT-00115) Break Away Headers - Machine Pin <https://www.sparkfun.com/products/117> (PRT-00117) Break Away Female Headers - Swiss Machine Pin <https://www.sparkfun.com/products/743> (PRT-00743) Stackable Header - 3 Pin (Female, 0.1") <https://www.sparkfun.com/products/13875> (PRT-13875) For SCREWTERMINALS and SPRING TERMINALS visit here: Screw Terimnals on SparkFun.com <https://www.sparkfun.com/search/results?term=Screw+Terminals> (5mm/3.5mm/2.54mm spacing) This device is also useful as a general connection point to wire up your design to another part of your project. Our various solder wires solder well into these plated through hole pads. Hook-Up Wire - Assortment (Stranded, 22 AWG) <https://www.sparkfun.com/products/11375> (PRT-11375) Hook-Up Wire - Assortment (Solid Core, 22 AWG) <https://www.sparkfun.com/products/11367> (PRT-11367) View the entire wire category on our website here <https://www.sparkfun.com/categories/141> Special notes: Molex polarized connector foot print use with SKU : PRT-08232 with associated crimp pins and housings.; PROD_ID: XXX-00000
L1 L2 = SparkFun-Coils:INDUCTOR-XFL4020; PROD_ID: INDUC-13855
MCU_UART = pinhead:PINHD-1X4: PIN HEADER
Q1 = SparkFun-DiscreteSemi:MOSFET-NCH: N-channel MOSFETs Voltage controlled devices that allow control of high current outputs. SparkFun Products: SparkFun OpenScale <https://www.sparkfun.com/products/13261> SparkFun Digital Sandbox <https://www.sparkfun.com/products/12651> SparkFun Monster Moto Shield <https://www.sparkfun.com/products/10182> SparkFun MOSFET Power Controller <https://www.sparkfun.com/products/11214>; PROD_ID: TRANS-00830
R1 R2 R7-R12 R14 R15 R25 RT2 = adafruit:R-US_: RESISTOR, American symbol
R3-R6 R13 R16-R24 R26-R33 = rcl:R-US_: RESISTOR, American symbol; SPICEPREFIX: R
SOLAR = adafruit:DCBARREL: 2.0mm DC Barrel Jack DCJACK_2MM_PTH - Through Hole Jack (4UConnector: 05537)
U1 U4 = SparkFun-IC-Power:TPS63070; PROD_ID: IC-14258
U2 = STM32F767ZIT6:STM32F767ZIT6: IC MCU 32BIT 2MB FLASH 144LQFP; DESCRIPTION: High-performance and DSP with FPU, ARM Cortex-M7 MCU with 2 Mbytes Flash, 216 MHz CPU, Art Accelerator, L1 cache, SDR...; DIGI-KEY_PART_NUMBER: 497-16521-ND; DIGI-KEY_PURCHASE_URL: https://www.digikey.com/product-detail/en/stmicroelectronics/STM32F767ZIT6/497-16521-ND/6004736?utm_source=snapeda&utm_medium=aggregator&utm_campaign=symbol; MF: STMicroelectronics; MP: STM32F767ZIT6; PACKAGE: LQFP-144 STMicroelectronics
U3 = STM32L053C8T6:STM32L053C8T6: Ultra-low-power ARM Cortex-M0+ MCU with 64 Kbytes Flash, 32 MHz CPU, USB, LCD; DESCRIPTION: Ultra-low-power ARM Cortex-M0+ MCU with 64 Kbytes Flash, 32 MHz CPU, USB, LCD; DIGI-KEY_PART_NUMBER: 497-14906-ND; DIGI-KEY_PURCHASE_URL: https://www.digikey.com/product-detail/en/stmicroelectronics/STM32L053C8T6/497-14906-ND/4935255?utm_source=snapeda&utm_medium=aggregator&utm_campaign=symbol; MF: STMicroelectronics; MP: STM32L053C8T6; PACKAGE: LQFP-48 STMicroelectronics
U5 = ForestVisionParts:BATTERY-MANAGEMENT-TEMP_BQ27441-G1
U$1 = ForestVisionParts:MIKROE_CLICK
U$2 U$3 = ForestVisionParts:8MHZ_OSC
U$9 = ForestVisionParts:LORAMODULE: RF95W

## Board
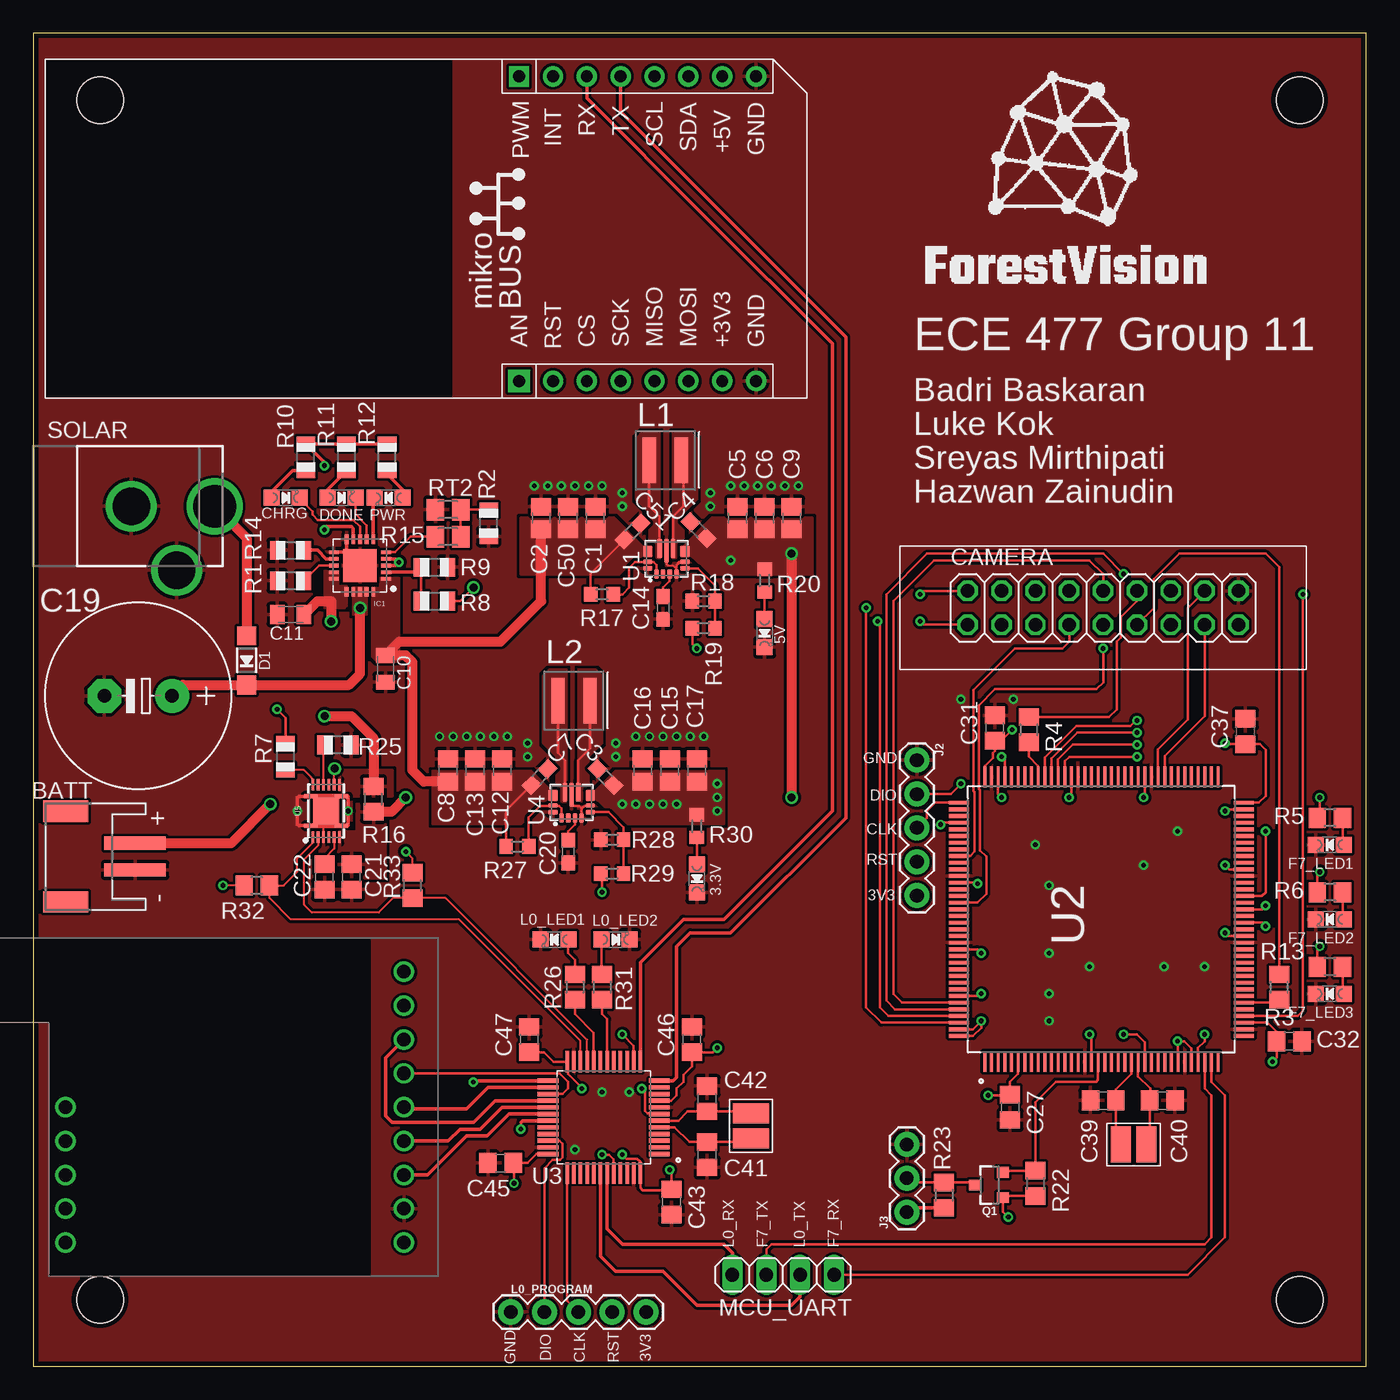
[diagram p3: board, top side]
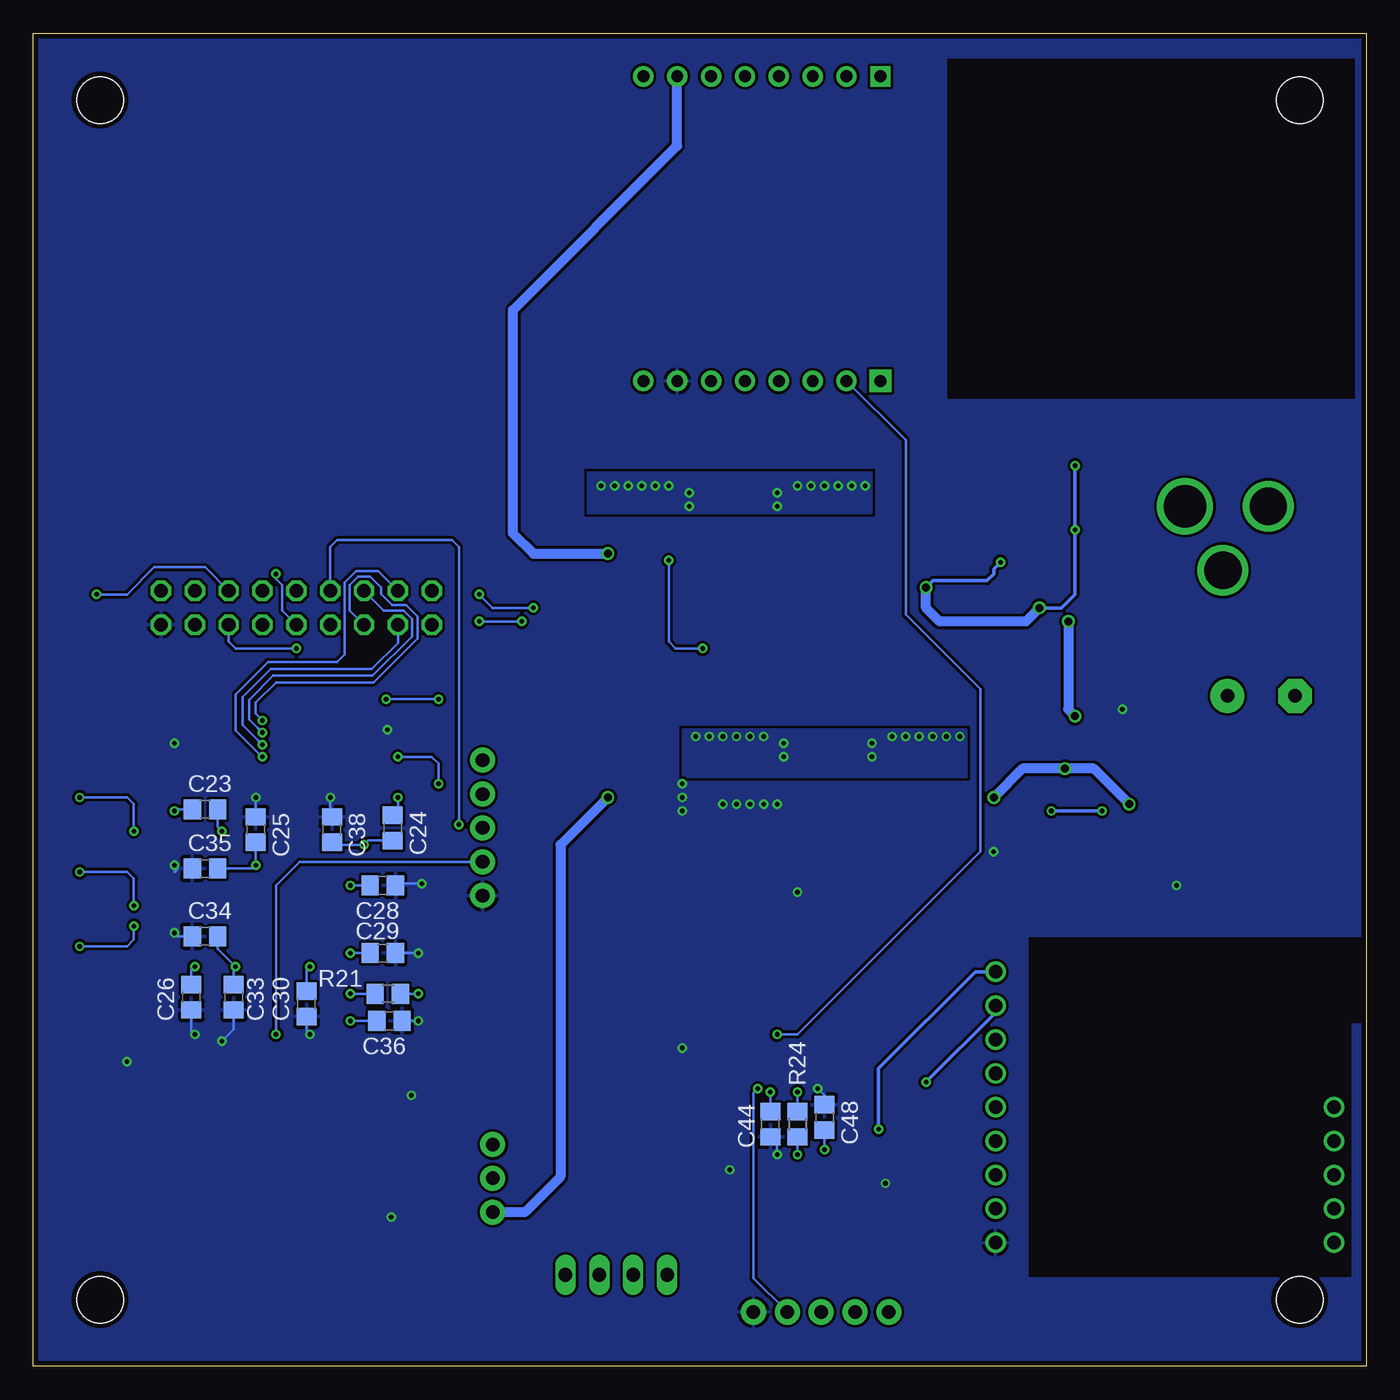
[diagram p4: board, bottom side, seen from below]

Size 100 x 100 mm. Coordinates in mm from the lower left corner, seen from the top.
Outline: 0,0 100,0 100,100 0,100 0,0
Copper layers (1*16): Top 0.0356mm / dielectric 1.5011mm / Bottom 0.0356mm
Design rules "ECE_Senior_Design": minimum track width 6mil, minimum drill 13mil, track to track 8mil, track to pad 8mil, pad to pad 5mil, via to via 8mil, smd to smd 5mil, copper to edge 15mil, drill to drill 8mil, minimum pad ring 7mil, minimum via ring 7mil, stop-mask expansion 3mil, vias tented up to drill 0mil, thermal gap 10mil
Holes 3.5 mm at 95,95 5,95 5,5 95,5

### Footprints (pad centres in the part's own frame; a part is rotated, then mirrored left to right if it is on the bottom)
CHIPLED_0805_NOOUTLINE = smd 1.2 x 1.2: A 0,-1.05; C 0,1.05
JST-PH-2-SMT-RA = smd 1 x 4.6: 1 1,-3.7; 2 -1,-3.7 | smd 1.6 x 3.4: NC1 -3.4,1.5; NC2 3.4,1.5
C0805 = smd 1.3 x 1.5: 1 -0.85,0; 2 0.85,0
C0603 = smd 1.1 x 1: 1 -0.85,0; 2 0.85,0
C0805K = smd 1.1 x 1.4: 1 -1,0; 2 1,0
ADAFRUIT_E5-13 = drill 1.016 pad 2.54: + -2.54,0 | drill 1.016 pad 2.54 octagon: - 2.54,0
C0805' = smd 1.3 x 1.5: 1 -0.95,0; 2 0.95,0
TST-109-02-X-D = drill 1.016 octagon: 1 -10.16,-1.27; 2 -10.16,1.27; 3 -7.62,-1.27; 4 -7.62,1.27; 5 -5.08,-1.27; 6 -5.08,1.27; 7 -2.54,-1.27; 8 -2.54,1.27; 9 0,-1.27; 10 0,1.27; 11 2.54,-1.27; 12 2.54,1.27; 13 5.08,-1.27; 14 5.08,1.27; 15 7.62,-1.27; 16 7.62,1.27; 17 10.16,-1.27; 18 10.16,1.27
MICROBUILDER_SOD-123 = smd 1.4 x 1.4: A 1.85,0; C -1.85,0
QFN20_4MM = smd 0.73 x 0.28: P$1 -1.965,1; P$2 -1.965,0.5; P$3 -1.965,0; P$4 -1.965,-0.5; P$5 -1.965,-1; P$11 1.965,-1; P$12 1.965,-0.5; P$13 1.965,0; P$14 1.965,0.5; P$15 1.965,1 | smd 0.28 x 0.73: P$6 -1,-1.965; P$7 -0.5,-1.965; P$8 0,-1.965; P$9 0.5,-1.965; P$10 1,-1.965; P$16 1,1.965; P$17 0.5,1.965; P$18 0,1.965; P$19 -0.5,1.965; P$20 -1,1.965 | smd 2.5 x 2.5: P$21 0,0
1X05 = drill 1.016 pad 1.88: 1 0,0; 2 2.54,0; 3 5.08,0; 4 7.62,0; 5 10.16,0
1X03 = drill 1.016 pad 1.88: 1 0,0; 2 2.54,0; 3 5.08,0
XFL4020 = smd 0.98 x 3.4: P$1 1,1.8; P$2 3.4,1.8
1X04 = drill 1.016 long: 1 -3.81,0; 2 -1.27,0; 3 1.27,0; 4 3.81,0
SOT23-3 = smd 0.8 x 0.9: 1 -0.95,-1; 2 0.95,-1; 3 0,1.1
R0805 = smd 1.1 x 1.4: 1 -1,0; 2 1,0
R0805' = smd 1.3 x 1.5: 1 -0.95,0; 2 0.95,0
M0805 = smd 1.3 x 1.6: 1 -0.95,0; 2 0.95,0
R0603 = smd 1 x 1.1: 1 -0.85,0; 2 0.85,0
DCJACK_2MM_PTH = drill 2.8: GND 0,7.35; GNDBREAK 4.8,10.75 | drill 3.2: PWR 0,13.6
VQFN-15-HR(3X2.5) = smd 0.7 x 0.35: P$1 -1.15,0.75; P$2 -1.15,0.25; P$3 -1.15,-0.25; P$4 -1.15,-0.75 | smd 0.35 x 0.7: P$5 -0.725,-1.4; P$6 -0.225,-1.4; P$14 -0.225,1.4; P$15 -0.725,1.4 | smd 0.85 x 0.7: P$7/8 0.525,-1.4; P$12/13 0.525,1.4 | smd 1.45 x 0.35: P$9 0.775,-0.5; P$11 0.775,0.5 | smd 1.8 x 0.35: P$10 0.6,0
QFP50P2200X2200X160-144N = smd 1.56 x 0.28: 1 -10.68,8.75; 2 -10.68,8.25; 3 -10.68,7.75; 4 -10.68,7.25; 5 -10.68,6.75; 6 -10.68,6.25; 7 -10.68,5.75; 8 -10.68,5.25; 9 -10.68,4.75; 10 -10.68,4.25; 11 -10.68,3.75; 12 -10.68,3.25; 13 -10.68,2.75; 14 -10.68,2.25; 15 -10.68,1.75; 16 -10.68,1.25; 17 -10.68,0.75; 18 -10.68,0.25; 19 -10.68,-0.25; 20 -10.68,-0.75; 21 -10.68,-1.25; 22 -10.68,-1.75; 23 -10.68,-2.25; 24 -10.68,-2.75; 25 -10.68,-3.25; 26 -10.68,-3.75; 27 -10.68,-4.25; 28 -10.68,-4.75; 29 -10.68,-5.25; 30 -10.68,-5.75; 31 -10.68,-6.25; 32 -10.68,-6.75; 33 -10.68,-7.25; 34 -10.68,-7.75; 35 -10.68,-8.25; 36 -10.68,-8.75; 73 10.68,-8.75; 74 10.68,-8.25; 75 10.68,-7.75; 76 10.68,-7.25; 77 10.68,-6.75; 78 10.68,-6.25; 79 10.68,-5.75; 80 10.68,-5.25; 81 10.68,-4.75; 82 10.68,-4.25; 83 10.68,-3.75; 84 10.68,-3.25; 85 10.68,-2.75; 86 10.68,-2.25; 87 10.68,-1.75; 88 10.68,-1.25; 89 10.68,-0.75; 90 10.68,-0.25; 91 10.68,0.25; 92 10.68,0.75; 93 10.68,1.25; 94 10.68,1.75; 95 10.68,2.25; 96 10.68,2.75; 97 10.68,3.25; 98 10.68,3.75; 99 10.68,4.25; 100 10.68,4.75; 101 10.68,5.25; 102 10.68,5.75; 103 10.68,6.25; 104 10.68,6.75; 105 10.68,7.25; 106 10.68,7.75; 107 10.68,8.25; 108 10.68,8.75 | smd 0.28 x 1.56: 37 -8.75,-10.68; 38 -8.25,-10.68; 39 -7.75,-10.68; 40 -7.25,-10.68; 41 -6.75,-10.68; 42 -6.25,-10.68; 43 -5.75,-10.68; 44 -5.25,-10.68; 45 -4.75,-10.68; 46 -4.25,-10.68; 47 -3.75,-10.68; 48 -3.25,-10.68; 49 -2.75,-10.68; 50 -2.25,-10.68; 51 -1.75,-10.68; 52 -1.25,-10.68; 53 -0.75,-10.68; 54 -0.25,-10.68; 55 0.25,-10.68; 56 0.75,-10.68; 57 1.25,-10.68; 58 1.75,-10.68; 59 2.25,-10.68; 60 2.75,-10.68; 61 3.25,-10.68; 62 3.75,-10.68; 63 4.25,-10.68; 64 4.75,-10.68; 65 5.25,-10.68; 66 5.75,-10.68; 67 6.25,-10.68; 68 6.75,-10.68; 69 7.25,-10.68; 70 7.75,-10.68; 71 8.25,-10.68; 72 8.75,-10.68; 109 8.75,10.68; 110 8.25,10.68; 111 7.75,10.68; 112 7.25,10.68; 113 6.75,10.68; 114 6.25,10.68; 115 5.75,10.68; 116 5.25,10.68; 117 4.75,10.68; 118 4.25,10.68; 119 3.75,10.68; 120 3.25,10.68; 121 2.75,10.68; 122 2.25,10.68; 123 1.75,10.68; 124 1.25,10.68; 125 0.75,10.68; 126 0.25,10.68; 127 -0.25,10.68; 128 -0.75,10.68; 129 -1.25,10.68; 130 -1.75,10.68; 131 -2.25,10.68; 132 -2.75,10.68; 133 -3.25,10.68; 134 -3.75,10.68; 135 -4.25,10.68; 136 -4.75,10.68; 137 -5.25,10.68; 138 -5.75,10.68; 139 -6.25,10.68; 140 -6.75,10.68; 141 -7.25,10.68; 142 -7.75,10.68; 143 -8.25,10.68; 144 -8.75,10.68
QFP50P900X900X160-48N = smd 1.56 x 0.28: 1 -4.18,2.75; 2 -4.18,2.25; 3 -4.18,1.75; 4 -4.18,1.25; 5 -4.18,0.75; 6 -4.18,0.25; 7 -4.18,-0.25; 8 -4.18,-0.75; 9 -4.18,-1.25; 10 -4.18,-1.75; 11 -4.18,-2.25; 12 -4.18,-2.75; 25 4.18,-2.75; 26 4.18,-2.25; 27 4.18,-1.75; 28 4.18,-1.25; 29 4.18,-0.75; 30 4.18,-0.25; 31 4.18,0.25; 32 4.18,0.75; 33 4.18,1.25; 34 4.18,1.75; 35 4.18,2.25; 36 4.18,2.75 | smd 0.28 x 1.56: 13 -2.75,-4.18; 14 -2.25,-4.18; 15 -1.75,-4.18; 16 -1.25,-4.18; 17 -0.75,-4.18; 18 -0.25,-4.18; 19 0.25,-4.18; 20 0.75,-4.18; 21 1.25,-4.18; 22 1.75,-4.18; 23 2.25,-4.18; 24 2.75,-4.18; 37 2.75,4.18; 38 2.25,4.18; 39 1.75,4.18; 40 1.25,4.18; 41 0.75,4.18; 42 0.25,4.18; 43 -0.25,4.18; 44 -0.75,4.18; 45 -1.25,4.18; 46 -1.75,4.18; 47 -2.25,4.18; 48 -2.75,4.18
BATTERY-MANAGEMENT-TEMP_PDSO-N12 = smd 0.2 x 0.85: 1 -1,-1.975; 2 -0.6,-1.975; 3 -0.2,-1.975; 4 0.2,-1.975; 5 0.6,-1.975; 6 1,-1.975; 7 1,1.975; 8 0.6,1.975; 9 0.2,1.975; 10 -0.2,1.975; 11 -0.6,1.975; 12 -1,1.975 | smd 1.95 x 1.95: EP 0,0 | smd 1 x 0.25: EP1 -1.15,1.1; EP2 -1.15,-1.1; EP3 1.15,-1.1; EP4 1.15,1.1
MIKROE_BUS_LARGE = drill 0.889 pad 1.676 square: P$1 1.27,21.59 | drill 0.889 pad 1.524: P$2 1.27,19.05; P$3 1.27,16.51; P$4 1.27,13.97; P$5 1.27,11.43; P$6 1.27,8.89; P$7 1.27,6.35; P$8 1.27,3.81; P$9 24.13,3.81; P$10 24.13,6.35; P$11 24.13,8.89; P$12 24.13,11.43; P$13 24.13,13.97; P$14 24.13,16.51; P$15 24.13,19.05 | drill 0.889 pad 1.524 square: P$16 24.13,21.59
8MHZ_OSC = smd 1.5 x 2.7: P$1 -0.95,0; P$2 0.95,0
LORAMODULE = drill 1.02: CS 20.32,2.54; EN 7.62,2.54; G0 10.16,2.54; G1 2.54,27.94; G2 5.08,27.94; G3 7.62,27.94; G4 10.16,27.94; G5 12.7,27.94; GND 5.08,2.54; MISO 15.24,2.54; MOSI 17.78,2.54; PRST 22.86,2.54; SCK 12.7,2.54; VIN 2.54,2.54

### Placement (x,y rotation side)
3.3V  49.78,36.58 180 top
5V  54.86,54.99 180 top
BATT  3.94,38.23 90 top
C1  42.16,63.63 90 top
C2  38.1,63.63 90 top
C3  42.93,44.2 135 top
C4  49.91,62.74 135 top
C5  52.83,63.63 90 top
C6  54.86,63.63 90 top
C7  37.97,44.2 45 top
C8  31.11,44.7 90 top
C9  56.9,63.63 90 top
C10  26.42,52.32 270 top
C11  19.3,56.39 180 top
C12  35.18,44.7 90 top
C13  33.15,44.7 90 top
C14  47.24,56.9 270 top
C15  47.75,44.7 90 top
C16  45.72,44.7 90 top
C17  49.78,44.7 90 top
C19  7.87,50.29 180 top
C20  40.13,38.61 270 top
C21  1uF  [C0805']  23.88,36.7 270 top
C22  0.47uF  [C0805']  21.84,36.7 270 top
C23  2.2uF  [C0805']  87.12,41.78 0 bottom
C24  2.2uF  [C0805']  73.03,40.39 270 bottom
C25  10nF  [C0805']  83.31,40.26 270 bottom
C26  100nF  [C0805']  88.14,27.69 90 bottom
C27  100nF  [C0805']  73.28,19.43 270 top
C28  100nF  [C0805']  73.79,36.07 180 bottom
C29  100nF  [C0805']  73.79,30.99 180 bottom
C30  100nF  [C0805']  79.5,27.18 90 bottom
C31  100nF  [C0805']  72.14,47.88 90 top
C32  100nF  [C0805']  94.23,24.38 0 top
C33  100nF  [C0805']  84.96,27.69 90 bottom
C34  100nF  [C0805']  87.12,32.26 0 bottom
C35  100nF  [C0805']  87.12,37.34 0 bottom
C36  100nF  [C0805']  73.28,25.91 180 bottom
C37  100nF  [C0805']  90.93,47.62 90 top
C38  4.7uF  [C0805']  77.6,40.26 270 bottom
C39  4.3pF  [C0805']  80.26,19.94 180 top
C40  4.3pF  [C0805']  84.71,19.94 0 top
C41  4.3pF  [C0805']  50.55,15.88 270 top
C42  4.3pF  [C0805']  50.55,20.07 90 top
C43  100nF  [C0805']  47.88,12.32 270 top
C44  100nF  [C0805']  44.7,18.16 90 bottom
C45  100nF  [C0805']  35.05,15.24 180 top
C46  100nF  [C0805']  49.4,24.51 90 top
C47  100nF  [C0805']  37.21,24.51 90 top
C48  1uF  [C0805']  40.64,18.67 270 bottom
C50  40.13,63.63 90 top
C51  44.96,62.61 45 top
CAMERA  80.26,56.9 0 top
CHRG  18.92,65.15 270 top
D1  16,52.96 90 top
DONE  23.11,65.15 270 top
F7_LED1  97.28,39.12 90 top
F7_LED2  97.28,33.53 90 top
F7_LED3  97.28,27.94 90 top
FRAME2  89.66,36.7 90 top
FRAME3  21.08,-10.67 0 top  (outside the outline)
IC1  24.51,60.07 180 top
J2  66.29,45.47 270 top
J3  65.53,11.56 90 top
L0_LED1  39.12,32 90 top
L0_LED2  43.69,32 270 top
L0_PROGRAM  35.81,4.06 0 top
L1  45.21,66.17 0 top
L2  38.35,48.13 0 top
MCU_UART  56.26,6.86 180 top
PWR  26.67,65.15 90 top
Q1  71.75,13.59 90 top
R1  19.3,58.93 0 top
R2  34.16,63.25 90 top
R3  ???  [R0805']  93.47,28.45 90 top
R4  ???  [R0805']  74.68,47.75 270 top
R5  10k  [R0805']  97.28,41.15 180 top
R6  10k  [R0805']  97.28,35.56 180 top
R7  18.92,45.72 90 top
R8  30.1,57.4 0 top
R9  30.1,59.94 0 top
R10  20.45,68.2 90 top
R11  23.5,68.2 90 top
R12  26.54,68.2 90 top
R13  10k  [R0805']  97.28,29.97 180 top
R14  19.3,61.21 0 top
R15  31.11,62.23 0 top
R16  0.01  [R0805']  25.53,42.55 90 top
R17  42.67,57.91 180 top
R18  50.29,57.4 0 top
R19  50.29,55.37 180 top
R20  54.86,58.93 90 top
R21  10k  [R0805']  73.41,27.94 180 bottom
R22  10k  [R0805']  75.18,13.72 270 top
R23  10k  [R0805']  68.33,12.83 270 top
R24  10k  [R0805']  42.67,18.16 270 bottom
R25  22.86,46.61 180 top
R26  10k  [R0805']  40.64,28.45 270 top
R27  36.32,38.99 180 top
R28  43.43,39.5 0 top
R29  43.43,36.96 180 top
R30  49.78,40.51 90 top
R31  10k  [R0805']  42.67,28.45 270 top
R32  [R0805']  16.76,36.07 180 top
R33  [R0805']  28.45,36.07 90 top
RT2  31.11,64.26 0 top
SOLAR  0,64.52 270 top
U1  47.5,60.58 90 top
U2  80.14,33.53 90 top
U3  42.8,18.67 180 top
U4  40.39,42.29 90 top
U5  21.97,41.66 0 top
U$1  58.04,72.64 90 top
U$2  82.55,16.64 0 top
U$3  53.85,18.03 90 top
U$9  30.35,6.73 90 top

### Tracks (layer width: path | path; a pad name or v marks a point on that pad's centre or on a via)
!EN
  Top 0.203: R17.1 44.2,57.91 44.7,58.42 44.7,59.89 45.15,60.33 46.08,60.33 U1.P$14 46.12,60.33 46.54,60.33 46.75,60.12 46.75,59.58 U1.P$1
!EN1
  Top 0.203: R27.1 37.17,41.19 38.03,42.05 38.99,42.05 U4.P$14 39.01,42.05 39.43,42.05 39.64,41.84 39.64,41.3 39.64,41.29 U4.P$1
+3V3  (via drill 0.35)
  Top 0.152: R33.2 28.45,38.1 v27.94,38.61 | R32.2 v14.22,36.07
  Top 0.203: C47.1 38.32,23.56 39.03,22.85 U3.24 40.1,22.79 40.1,21.95 41.15,20.91 v41.15,20.83 | R7.2 18.92,48.64 v18.29,49.28 | v47.75,14.73 47.88,14.61 C43.1 47.82,13.21 45.72,13.21 45.55,13.38 U3.48 45.55,15.33 45.31,15.57 44.5,15.57 v44.2,15.88 | R22.2 72.88,12.77 Q1.1 72.75,11.57 v73.15,11.18 | U3.9 47.86,19.92 48.26,20.32 48.26,20.83 48.77,21.34 48.77,21.84 49.4,22.48 C46.1 50.99,23.56 v51.31,23.88 | U3.36 37.76,15.92 37.08,15.24 C45.1 36.07,15.17 v36.07,13.72 | U2.121 70.77,36.28 v70.84,36.2 | U2.17 79.39,24.75 v79.25,24.89 | U2.30 85.89,24.35 v85.85,24.38 86.36,24.38 86.89,23.86 U2.32 | U2.33 87.39,23.89 87.88,24.38 v87.88,24.89 | U2.52 89.64,32.28 v89.41,32.51 | U2.84 83.39,42.75 v83.31,42.67 | U2.95 77.89,42.84 v77.72,42.67 | U2.131 70.83,31.28 v71.12,30.99 | U2.108 71.39,45.04 71.99,45.64 71.99,45.99 72.14,46.14 C31.1 72.62,46.93 v73.44,47.75 | U2.39 92.59,25.78 93.28,25.08 C32.1 93.28,23.18 v92.96,22.86 | U2.143 70.49,25.28 v71.12,25.91 71.12,25.4 70.5,24.78 U2.144 | U2.6 73.89,21.94 73.28,21.34 C27.1 73.22,20.32 v71.63,20.32 | U2.72 91.94,42.28 92.46,42.8 92.46,46.23 92.01,46.67 C37.1 89.47,46.67 v89.41,46.74 | R29.2 42.67,36.87 v42.67,35.56 | U2.62 89.72,37.28 v89.41,37.59
  Bottom 0.203: v41.15,20.83 40.64,20.32 C48.1 | C44.1 44.2,16.7 v44.2,15.88 | C28.1 72.7,36.2 v70.84,36.2 | C30.1 79.5,25.15 v79.25,24.89 | C33.1 84.96,25.27 v85.85,24.38 | C26.1 88.14,25.15 v87.88,24.89 | C34.1 89.15,32.26 v89.41,32.51 | 89.15,37.34 89.41,37.08 | C25.1 v83.31,42.67 | C38.1 77.72,41.34 v77.72,42.67 | C29.1 v71.12,30.99 | C36.1 v71.12,25.91
  other vias: 44.2,42.16 45.21,42.16 46.23,42.16 47.24,42.16 48.26,42.16 51.31,41.66 51.31,42.67 51.31,43.69
  pour Top (rank 2, no thermals): 41.53,42.42 41.53,43.18 42.16,43.18 43.69,44.7 51.82,44.7 51.82,40.64 44.2,40.64 42.42,42.42
  pour Bottom (rank 6): 0,100 100,100 100,0 0,0
+5V  (via drill 0.35, 0.6)
  Top 0.203: R19.2 49.44,54.19 v49.78,53.85
  Top 0.254: R23.2 65.85,11.88 J3.1
  Top 0.762: v56.9,60.96 v56.9,42.67
  Bottom 0.203: v49.78,53.85 51.82,53.85 52.32,54.36 v52.32,60.45
  Bottom 0.762: v56.9,42.67 60.45,39.12 60.45,14.22 63.12,11.56 J3.1 | v56.9,60.96 62.48,60.96 64.01,62.48 64.01,79.25 51.69,91.57 U$1.P$10
  pour Top (no thermals): 48.64,61.47 48.64,60.71 49.53,60.71 50.8,59.44 58.42,59.44 58.42,63.63 50.93,63.63 48.77,61.47
BAT_SCL
  Top 0.152: U5.2 21.37,39.08 20.32,38.03 20.32,34.61 20.89,34.04 25.91,34.04 26.99,35.12 R33.1 30.92,35.12 41.55,24.49 U3.21
BAT_SDA
  Top 0.152: U3.22 41.05,24.42 31.94,33.53 19.3,33.53 17.71,35.12 R32.1 18.8,36.07 19.81,37.08 19.81,38.1 20.97,39.26 U5.1
CAM_PWDN  (via drill 0.35)
  Top 0.203: U2.142 63.63,25.78 62.48,26.92 v62.48,56.9 | v66.55,57.91 66.8,58.17 CAMERA.2
  Bottom 0.203: v62.48,56.9 65.53,56.9 v66.55,57.91
CAM_RET  (via drill 0.35)
  Top 0.203: U2.141 64.15,26.28 63.5,26.92 63.5,55.73 v63.35,55.88 | v66.55,55.88 66.8,55.63 CAMERA.1
  Bottom 0.203: v63.35,55.88 v66.55,55.88
CAM_SCL
  Top 0.203: U2.81 84.89,45.77 87.88,48.77 CAMERA.15
CAM_SDA
  Top 0.203: U2.82 84.39,46.29 86.61,48.51 86.61,56.9 CAMERA.16
CAM_XCLK
  Top 0.203: R4.2 74.68,45.75 75.39,45.04 U2.100
CS_LORA  (via drill 0.35)
  Top 0.254: U3.25 33.13,21.42 v33.02,21.31
  Bottom 0.254: v33.02,21.31 27.81,26.52 U$9.CS
DCMI_D0  (via drill 0.35)
  Top 0.203: U2.96 77.39,45.39 77.71,45.72 v82.8,45.72
  Bottom 0.203: CAMERA.4 74.12,59.64 75.79,59.64 76.66,58.78 76.66,53.39 77.22,52.83 82.39,52.83 84.81,50.41 84.81,47.71 82.83,45.72 v82.8,45.72
DCMI_D1  (via drill 0.35)
  Top 0.203: U2.97 76.89,45.52 77.99,46.63 v82.8,46.63
  Bottom 0.203: CAMERA.3 72.64,54.27 74.6,52.31 82.2,52.31 84.31,50.2 84.31,48.12 83.12,46.93 83.08,46.88 82.83,46.63 v82.8,46.63
DCMI_D2  (via drill 0.35)
  Top 0.203: U2.98 76.39,45.6 78.33,47.54 v82.8,47.54
  Bottom 0.203: CAMERA.6 73.71,56.69 72.2,56.69 71.58,56.07 71.58,54.76 74.53,51.81 82,51.81 83.81,49.99 83.81,48.52 83.18,47.89 83.08,47.79 82.83,47.54 v82.8,47.54
DCMI_D3  (via drill 0.35)
  Top 0.203: v82.8,48.45 82.7,48.45 82.3,48.04 78.25,48.04 75.89,45.67 U2.99
  Bottom 0.203: v82.8,48.45 83.31,48.95 83.31,49.78 81.79,51.31 74.45,51.31 71.17,54.59 71.17,56.24 72.03,57.1 73.09,57.1 73.91,57.93 73.91,58.41 74.74,59.23 75.63,59.23 76.25,58.61 76.25,56.69 CAMERA.5
DCMI_D4  (via drill 0.35)
  Top 0.203: U2.112 68.21,40.78 v68.07,40.64
  Bottom 0.203: v68.07,40.64 68.07,61.47 68.58,61.98 77.22,61.98 77.72,61.47 CAMERA.8
DCMI_D5
  Top 0.203: CAMERA.7 77.72,54.36 77.22,53.85 73.66,53.85 70.54,50.72 70.54,43.15 70.61,43.08 70.61,38.6 70.29,38.28 U2.117
DCMI_D6
  Top 0.203: U2.139 65.18,27.28 64.52,27.94 64.52,57.4 67.56,60.45 79.25,60.45 80.26,59.44 CAMERA.10
DCMI_D7  (via drill 0.35)
  Top 0.203: U2.140 64.66,26.78 64.01,27.43 64.01,57.91 67.06,60.96 80.26,60.96 v81.79,59.44
  Bottom 0.203: CAMERA.9 81.33,56.69 81.33,58.61 81.79,59.06 v81.79,59.44
DCMI_HSYNC  (via drill 0.35)
  Top 0.203: U2.40 94.86,26.28 95.25,26.67 v95.25,57.91
  Bottom 0.203: CAMERA.14 87.12,59.94 90.93,59.94 92.96,57.91 v95.25,57.91
DCMI_PIXCLK
  Top 0.203: U2.42 93.25,27.28 R3.1
DCMI_VSYNC  (via drill 0.35)
  Top 0.203: U2.124 70.85,34.78 71.5,35.43 71.5,38.23 71.02,38.71 71.02,43.25 70.94,43.32 70.94,49.58 72.16,50.8 79.76,50.8 80.26,51.31 v80.26,53.85
  Bottom 0.203: v80.26,53.85 84.84,53.85 85.34,54.36 CAMERA.13
F7_LED1  (via drill 0.35)
  Top 0.203: v96.52,42.67 96.52,41.34 R5.2 | U2.58 92.17,35.28 92.46,35.56 v92.46,40.13
  Bottom 0.203: v92.46,40.13 92.46,42.16 92.96,42.67 v96.52,42.67
F7_LED2  (via drill 0.35)
  Top 0.203: U2.56 92.19,34.28 v92.46,34.54 | v96.52,37.08 96.33,36.9 R6.2
  Bottom 0.203: v92.46,34.54 92.46,36.58 92.96,37.08 v96.52,37.08
F7_LED3  (via drill 0.35)
  Top 0.203: U2.54 92.2,33.28 v92.46,33.02 | v96.52,31.5 96.33,31.31 R13.2
  Bottom 0.203: v92.46,33.02 92.46,32 92.96,31.5 v96.52,31.5
F7_RST  (via drill 0.35)
  Top 0.203: U2.25 83.39,24.31 82.8,24.89 v81.79,24.89
  Bottom 0.203: v81.79,24.89 81.79,36.07 80.01,37.85 J2.4
F7_RX
  Top 0.203: U2.35 88.39,21.34 89.41,20.32 89.41,9.65 86.61,6.86 MCU_UART.1
F7_TX
  Top 0.203: U2.34 87.88,20.83 88.39,20.32 88.39,9.65 87.88,9.14 55.37,9.14 54.99,8.76 MCU_UART.3
GND  (via drill 0.35)
  Top 0.152: U5.3 21.77,40.57 | U1.P$10 47.5,60.2 47.64,60.06 48.01,60.06 48.12,59.94 48.24,59.94 | U1.P$6 48.85,60.31 48.46,60.31 48.25,60.09 U1.P$4
  Top 0.203: 21.77,40.57 21.76,40.56 U5.EP2 | U1.P$6 48.88,60.33 48.45,60.33 48.24,60.12 48.24,59.94 | 41.13,41.84 41.13,41.3 41.14,41.29 U4.P$4 | 41.13,41.84 41.34,42.05 41.77,42.05 U4.P$6 | 41.13,41.84 40.93,42.04 40.62,42.04 40.39,42.27 U4.P$10
  Top 0.254: U5.EP3 23.62,40.56 v23.62,41.66 23.62,42.76 U5.EP4 | U5.EP1 19.9,42.76 19.81,42.67 v19.81,41.66 19.81,40.64 19.9,40.56 U5.EP2 | IC1.P$10 23.51,61.07 | IC1.P$11 23.51,61.07 | 23.51,61.07 IC1.P$21
  Bottom 0.203: v42.67,20.57 R24.1 | v44.7,20.57 C44.2 | C33.2 84.96,29.84 v84.84,29.97 86.17,31.31 C34.2 | C26.2 88.14,29.72 v87.88,29.97 | C23.2 86.17,40.45 v85.85,40.13 | C35.2 83.57,37.34 v83.31,37.59 C25.2 | C24.2 74.86,39.44 v75.18,39.12 77.4,39.12 C38.2 | C28.2 v76.2,36.07 | C29.2 v76.2,30.99 | R21.2 v76.2,27.94 | C36.2 v76.2,25.91 | C30.2 79.5,29.72 v79.25,29.97 | C48.2 v40.64,16.26 | v73.53,50.04 v69.6,50.04
  Bottom 0.254: v23.62,41.66 v19.81,41.66
  other vias: 39.62,66.04 40.64,66.04 41.66,66.04 42.67,66.04 44.2,65.53 44.2,64.52 50.8,64.52 50.8,65.53 52.32,66.04 53.34,66.04 54.36,66.04 55.37,66.04 56.39,66.04 57.4,66.04 37.59,66.04 38.61,66.04 30.48,47.24 31.5,47.24 32.51,47.24 33.53,47.24 34.54,47.24 35.56,47.24 37.08,46.74 37.08,45.72 43.69,45.72 43.69,46.74 45.21,47.24 46.23,47.24 47.24,47.24 48.26,47.24 49.28,47.24 50.29,47.24
  pour Top (rank 6): 0,100 100,100 100,0 0,0
  pour Bottom (no thermals): 58.42,64.01 37.08,64.01 37.08,67.06 58.42,67.06
  pour Bottom (no thermals): 51.31,44.2 29.97,44.2 29.97,47.75 51.31,47.75
GPOUT
  Top 0.152: U5.12 20.97,44.05 20.83,44.2 20.3,44.72 R7.1
GSM_RST  (via drill 0.35)
  Top 0.203: U3.14 45.05,24.04 v44.2,24.89
  Bottom 0.203: v44.2,24.89 42.67,24.89 28.96,38.61 28.96,50.8 34.54,56.39 34.54,69.47 U$1.P$2
L0_LED1
  Top 0.203: U3.20 42.05,25.01 40.64,26.42 R26.2
L0_LED2
  Top 0.203: U3.18 43.05,26.04 42.67,26.42 R31.2
L0_RST  (via drill 0.35)
  Top 0.203: v45.64,20.83 45.89,20.58 45.89,19.16 46.08,18.97 46.92,18.97 U3.7
  Bottom 0.203: v45.64,20.83 45.97,20.5 45.97,6.6 L0_PROGRAM.4
L0_RX
  Top 0.254: U3.43 43.05,10.29 44.2,9.14 51.82,9.14 52.45,8.51 MCU_UART.4
L0_SWCLK
  Top 0.203: U3.37 40.05,4.91 L0_PROGRAM.3
L0_SWDIO
  Top 0.203: L0_PROGRAM.2 38.35,14.86 38.97,15.47 39.52,15.47 39.7,15.66 39.7,16.68 39.46,16.92 U3.34
L0_TX
  Top 0.254: U3.42 42.55,8.25 43.69,7.11 47.24,7.11 49.78,4.57 56.9,4.57 57.53,5.21 MCU_UART.2
LORA_EN
  Top 0.254: U$9.EN 29.59,14.35 32.51,17.27 34.04,17.27 35.68,18.92 U3.30
LORA_INT
  Top 0.254: U$9.G0 31.11,16.89 32,17.78 33.53,17.78 35.17,19.42 U3.29
LORA_RST  (via drill 0.35)
  Top 0.203: 36.58,18.29 v36.58,17.78
  Top 0.254: U3.31 36.71,18.42 36.58,18.29
  Bottom 0.254: v36.58,17.78 36.58,22.35 29.34,29.59 U$9.PRST
MISO_LORA
  Top 0.203: U3.27 39.72,20.42 40.13,20.83 40.13,21.34 39.5,21.97 U$9.MISO
MOSI_LORA
  Top 0.254: U3.28 34.65,19.92 33.02,18.29 26.92,18.29 26.42,18.8 26.42,23.11 U$9.MOSI
N$1
  Top 0.203: U1.P$11 47,63.75 46.21,64.53 L1.P$1
  pour Top (rank 3, no thermals): 46.99,60.58 46.23,60.58 46.23,64.01 45.21,65.02 45.21,69.6 45.72,70.1 46.99,70.1
N$2
  Top 0.203: U1.P$9 48,63.75 48.77,64.52 48.77,67.81 L1.P$2
  pour Top (rank 3, no thermals): 48.01,70.1 49.28,70.1 49.78,69.6 49.78,65.02 48.77,64.01 48.77,60.58 48.01,60.58
N$3
  Top 0.203: R9.1 R8.1
  Top 0.254: IC1.P$2 28.73,59.57 R9.1
N$4
  Top 0.203: U1.P$5 49.87,59.85 51.14,58.59 R18.2 R19.1
N$5
  Top 0.203: 5V.A R20.1
N$6
  Top 0.203: C14.1 47.24,58.42 47.75,58.92 U1.P$3
N$7
  Top 0.203: U4.P$11 39.89,45.46 39.35,45.99 L2.P$1
  pour Top (rank 3, no thermals): 40.01,42.29 39.24,42.29 39.24,45.72 38.23,46.74 38.23,51.82 38.73,52.32 40.01,52.32
N$8
  Top 0.203: U4.P$9 40.89,45.46 41.75,46.33 L2.P$2
  pour Top (rank 3, no thermals): 40.89,52.32 42.16,52.32 42.67,51.82 42.67,46.74 41.66,45.72 41.66,42.29 40.89,42.29
N$9
  Top 0.203: U4.P$3 40.64,40.64 40.13,40.13 C20.1
N$10
  Top 0.254: IC1.P$6 25.51,65.04 PWR.C
N$11
  Top 0.203: IC1.P$7 25.01,63.07 24.16,63.91 DONE.C
N$12
  Top 0.203: IC1.P$8 24.51,62.99 24,63.5 21.34,63.5 20.95,63.88 20.95,64.14 19.97,65.12 CHRG.C
N$13
  Top 0.254: CHRG.A 17.87,65.62 19.45,67.2 R10.1
N$14
  Top 0.254: DONE.A 22.06,65.75 23.5,67.18 R11.1
N$15
  Top 0.254: PWR.A 27.72,65.75 26.54,66.93 R12.1
N$16
  Top 0.254: IC1.P$12 21.98,60.57 21.34,61.21 R14.2
N$17
  Top 0.203: R1.2 21.45,60.07 IC1.P$13
N$18
  Top 0.203: IC1.P$5 27.16,61.07 28.32,62.23 R15.1
N$19
  Top 0.203: R15.2 RT2.2 34.15,64.26 R2.2
N$20
  Top 0.203: R30.1 3.3V.A
N$21
  Top 0.203: U4.P$5 43.14,41.57 44.28,40.42 R28.2 R29.1
N$22  (via drill 0.6)
  Top 0.152: U5.8 22.57,44.8 v22.61,44.83
  Top 0.762: v17.78,42.16 14.84,39.23 BATT.1 | v27.94,42.67 26.86,41.59 R16.1
  Bottom 0.762: v17.78,42.16 20.45,44.83 v22.61,44.83 25.78,44.83 v27.94,42.67
  pour Top: 22.86,40.13 22.86,36.58 26.42,36.58 26.42,42.16 24.26,42.16 24.26,40.13
N$23  (via drill 0.35)
  Top 0.203: U2.138 70.96,27.78 v71.12,27.94
  Bottom 0.203: R21.1 v71.12,27.94
N$24  (via drill 0.35)
  Top 0.203: v42.67,15.88 43.18,15.88 43.55,15.51 U3.44
  Bottom 0.203: R24.2 v42.67,15.88
N$25
  Top 0.152: U5.5 22.57,38.83 21.84,38.1 C22.1
N$26
  Top 0.152: U5.10 21.77,46.52 R25.2
N$27
  Top 0.203: U2.24 82.89,21.76 83.82,20.83 83.82,20 C40.1 83.76,16.9 U$2.P$2
N$28
  Top 0.203: U2.23 82.39,21.93 81.21,20.76 C39.1 81.21,17.02 U$2.P$1
N$29
  Top 0.203: Q1.3 70.47,13.78 R23.1 65.85,13.78 J3.2
N$30
  Top 0.203: U3.6 48.39,18.42 49.09,19.12 C42.1 53.72,19.12 U$3.P$2
N$31
  Top 0.203: U3.5 48.12,17.92 49.22,16.82 C41.1 53.59,16.82 U$3.P$1
N$32
  Top 0.762: SOLAR.PWR 16,62.11 D1.A
N$33
  Top 0.203: CAMERA.11 84.07,56.9 84.07,59.05 85.98,60.96 92.46,60.96 93.47,59.94 R3.2
N$34
  Top 0.203: R4.1 80.71,48.7 81.28,49.28 81.28,54.36 81.61,54.69 81.61,56.2 82.8,57.39 CAMERA.12
N$35
  Top 0.203: R6.1 98.23,33.63 F7_LED2.A
N$36
  Top 0.203: R13.1 98.23,28.04 F7_LED3.A
N$37
  Top 0.203: R5.1 98.23,39.22 F7_LED1.A
N$38
  Top 0.203: R31.1 42.64,29.43 L0_LED2.A
N$40
  Top 0.203: R26.1 40.64,30.48 40.13,30.99 40.13,31.97 L0_LED1.A
RX_GSM
  Top 0.254: U3.13 45.55,30.31 48.77,33.53 51.82,33.53 59.94,41.66 59.94,76.71 50.29,86.36 41.53,95.12 U$1.P$14
SCK_LORA
  Top 0.254: U$9.SCK 27.94,19.3 32.51,19.3 34.13,20.92 U3.26
SERVO_PWM
  Top 0.203: U2.18 79.89,21.47 79.76,21.34 76.71,21.34 75.18,19.81 R22.1 72.88,14.67 Q1.2
SYS_JTCK_SWCLK
  Top 0.203: U2.109 67.68,42.28 67.06,41.66 67.06,41.15 J2.3
SYS_JTMS_SWDIO  (via drill 0.35)
  Top 0.203: J2.2 68.83,42.93 v69.6,43.69 | U2.105 72.89,45.48 v72.64,45.72
  Bottom 0.203: v72.64,45.72 70.1,45.72 69.6,45.21 v69.6,43.69
TX_GSM
  Top 0.254: U3.12 47.99,21.42 48.26,21.68 48.26,31.5 49.28,32.51 52.32,32.51 60.96,41.15 60.96,77.22 44.07,94.11 U$1.P$13
VBAT  (via drill 0.6)
  Top 0.762: C11.1 21.32,57.4 22.35,57.4 v22.35,55.88 | v21.84,48.77 23.88,48.77 25.53,47.12 R16.2
  Bottom 0.762: v22.35,55.88 22.35,49.28 v21.84,48.77
  pour Top (no thermals): 22.86,59.69 22.86,58.55 23.5,58.55 23.5,57.02 23.37,56.9 21.84,56.9 21.84,59.69
  pour Top: 22.86,43.18 22.86,44.7 26.92,44.7 26.92,42.8 24,42.8 24,43.18
VCAP1  (via drill 0.35)
  Top 0.203: U2.71 89.53,41.78 v89.41,41.66
  Bottom 0.203: C23.1 89.28,41.78 v89.41,41.66
VCAP2  (via drill 0.35)
  Top 0.203: U2.106 72.39,42.93 v72.64,42.67
  Bottom 0.203: v72.64,42.67 72.64,41.72 C24.1
VCC  (via drill 0.35, 0.6)
  Top 0.203: v33.02,58.42 32,57.4 R8.2
  Top 0.254: v21.84,62.74 21.97,62.99 23.88,62.99 24.01,62.86 IC1.P$9 | IC1.P$3 27.18,60.07 v27.43,60.33 27.19,60.57 IC1.P$4 | R12.2 R11.2 R10.2 21.84,67.8 v21.84,67.56
  Top 0.762: C19.+ 11.23,51.11 D1.C 23.68,51.11 24.51,51.94 v24.51,56.9
  Bottom 0.254: v24.51,56.9 22.86,56.9 21.84,57.91 v21.84,62.74 v21.84,67.56 | v27.43,60.33 27.94,59.82 27.94,59.44 28.45,58.93 32.51,58.93 v33.02,58.42
  Bottom 0.762: v24.51,56.9 25.53,55.88 32,55.88 33.02,56.9 v33.02,58.42
  pour Top (no thermals): 24,58.42 25.02,58.42 25.02,56.39 24,56.39
VOUT_CHARGER
  Top 0.203: R17.2 41.82,59.48 C51.1 | R27.2 35.47,41.7 C7.1
  Top 0.762: C8.1 29.3,43.85 28.45,44.7 28.45,52.82 27.94,53.32 C10.1 27.45,54.36 35.05,54.36 38.1,57.4 C2.1
  pour Top (rank 2, no thermals): 38.86,43.18 39.24,43.18 39.24,42.42 38.35,42.42 36.58,40.64 29.97,40.64 29.97,44.7 37.34,44.7
  pour Top (no thermals): 45.72,61.47 46.35,61.47 46.35,60.71 45.21,60.71 43.94,59.44 36.58,59.44 36.58,63.63 43.56,63.63
  pour Top (no thermals): 26.04,59.18 27.43,59.18 27.43,52.83 25.78,52.83 25.4,53.21 25.4,58.42 26.04,58.42

### Text on the board
tPlace: ECE 477 Group 11 | Badri Baskaran | Luke Kok | Sreyas Mirthipati | Hazwan Zainudin | GND | DIO | CLK | RST | 3V3 | L0_RX | F7_TX | L0_TX | F7_RX | GND | DIO | CLK | RST | 3V3